# Altium project Capstone_Mainboard_B.PrjPcb (part 2 of 3)

## Sheet Management_RP2040.SchDoc: Management Microcontroller
size B; CheckedBy: Jason Sullins; Author: Jordan Harris-Toovy; Revision: 0.2; SheetNumber: 2; SheetTotal: 22; Size: ANSI B
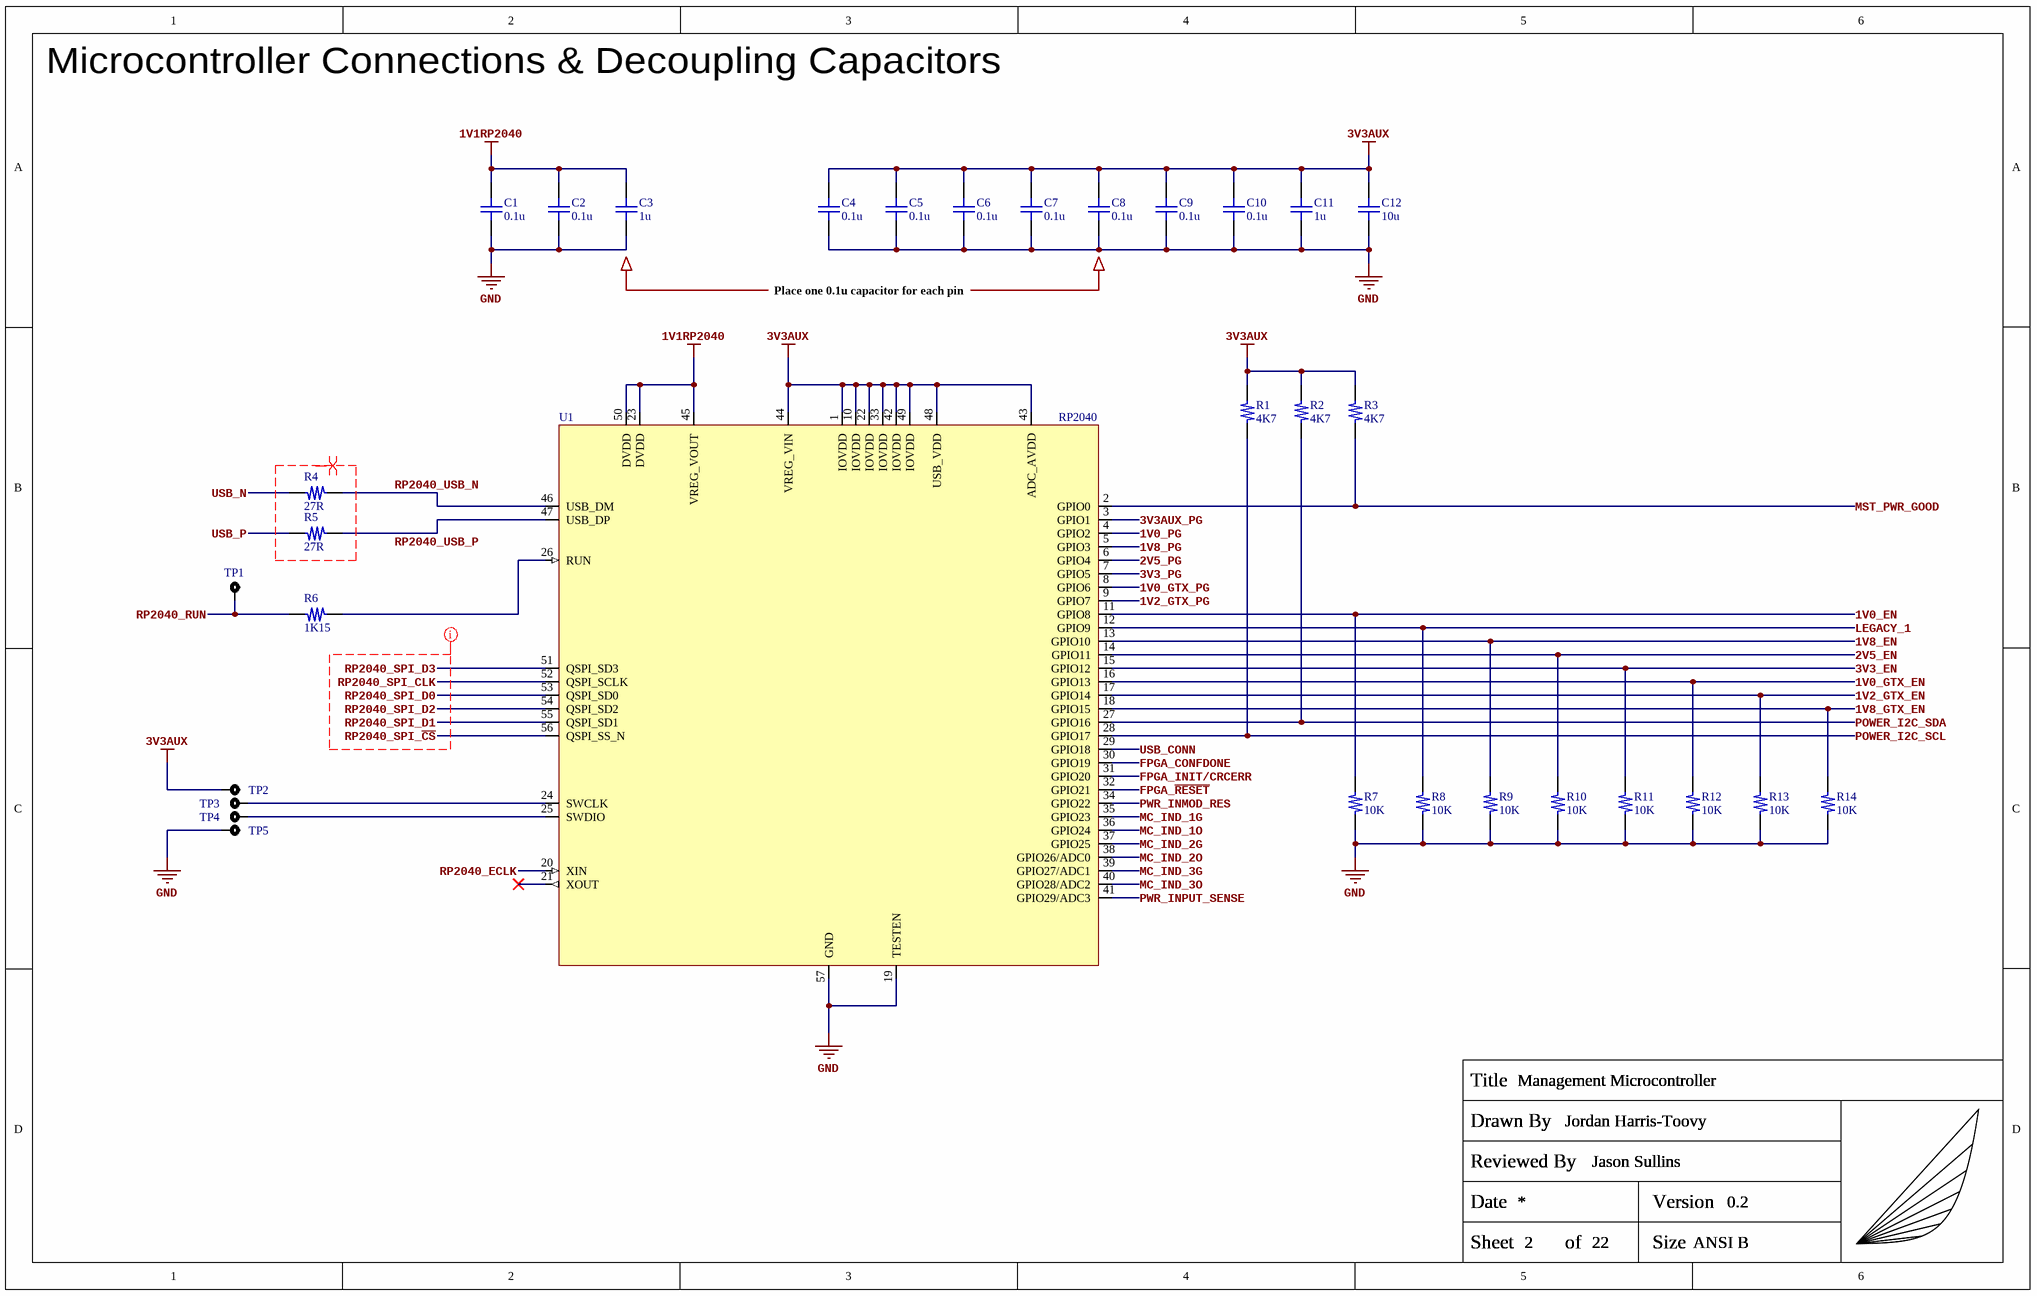
[diagram p11: Management_RP2040.SchDoc]

### Parts
(Parts that share a designator on the sheet are numbered #1, #2 ... from top to bottom, then left to right.)
C1  0.1u  [C_0402_Generic]
C2  0.1u  [C_0402_Generic]
C3  1u  [C_0402_Generic]
C4  0.1u  [C_0402_Generic]
C5  0.1u  [C_0402_Generic]
C6  0.1u  [C_0402_Generic]
C7  0.1u  [C_0402_Generic]
C8  0.1u  [C_0402_Generic]
C9  0.1u  [C_0402_Generic]
C10  0.1u  [C_0402_Generic]
C11  1u  [C_0402_Generic]
C12  10u  [C_0402_Generic]
R1  4K7  [R_0402_Generic]
R2  4K7  [R_0402_Generic]
R3  4K7  [R_0402_Generic]
R4  27R  [R_0402_Generic]
R5  27R  [R_0402_Generic]
R6  1K15  [R_0402_Generic]
R7  10K  [R_0402_Generic]
R8  10K  [R_0402_Generic]
R9  10K  [R_0402_Generic]
R10  10K  [R_0402_Generic]
R11  10K  [R_0402_Generic]
R12  10K  [R_0402_Generic]
R13  10K  [R_0402_Generic]
R14  10K  [R_0402_Generic]
TITLEBLOCK?#12  Capstone_Title_Block  (value not drawn)  (graphical)
TP1  RP2040_RUN Test Point  [TP_3MM]  (value not drawn)
TP2  3V3AUX Test Point  [TP_3MM]  (value not drawn)
TP3  SWCLK Test Point  [TP_3MM]  (value not drawn)
TP4  SWDIO Test Point  [TP_3MM]  (value not drawn)
TP5  SWDGND Test Point  [TP_3MM]  (value not drawn)
U1  RP2040  [RP2040/SC0914 QFN-56]

### Nets
1V1RP2040: C1.2 C2.2 C3.2 U1.23(DVDD) U1.45(VREG_VOUT) U1.50(DVDD)
3V3AUX: C4.2 C5.2 C6.2 C7.2 C8.2 C9.2 C10.2 C11.2 C12.2 R1.2 R2.2 R3.2 TP2.1 U1.1(IOVDD) U1.10(IOVDD) U1.22(IOVDD) U1.33(IOVDD) U1.42(IOVDD) U1.43(ADC_AVDD) U1.44(VREG_VIN) U1.48(USB_VDD) U1.49(IOVDD)
GND: C1.1 C2.1 C3.1 C4.1 C5.1 C6.1 C7.1 C8.1 C9.1 C10.1 C11.1 C12.1 R7.1 R8.1 R9.1 R10.1 R11.1 R12.1 R13.1 R14.1 TP5.1 U1.19(TESTEN) U1.57(GND)
1V0_EN: R7.2 U1.11(GPIO8)
1V0_GTX_EN: R12.2 U1.16(GPIO13)
1V0_GTX_PG: U1.8(GPIO6)
1V0_PG: U1.4(GPIO2)
1V2_GTX_EN: R13.2 U1.17(GPIO14)
1V2_GTX_PG: U1.9(GPIO7)
1V8_EN: R9.2 U1.13(GPIO10)
1V8_GTX_EN: R14.2 U1.18(GPIO15)
1V8_PG: U1.5(GPIO3)
2V5_EN: R10.2 U1.14(GPIO11)
2V5_PG: U1.6(GPIO4)
3V3_EN: R11.2 U1.15(GPIO12)
3V3_PG: U1.7(GPIO5)
3V3AUX_PG: U1.3(GPIO1)
FPGA_CONFDONE: U1.30(GPIO19)
FPGA_INIT/CRCERR: U1.31(GPIO20)
FPGA_~{RESET}: U1.32(GPIO21)
LEGACY_1: R8.2 U1.12(GPIO9)
MC_IND_1G: U1.35(GPIO23)
MC_IND_1O: U1.36(GPIO24)
MC_IND_2G: U1.37(GPIO25)
MC_IND_2O: U1.38(GPIO26/ADC0)
MC_IND_3G: U1.39(GPIO27/ADC1)
MC_IND_3O: U1.40(GPIO28/ADC2)
MST_PWR_GOOD: R3.1 U1.2(GPIO0)
POWER_I2C_SCL: R1.1 U1.28(GPIO17)
POWER_I2C_SDA: R2.1 U1.27(GPIO16)
PWR_INMOD_RES: U1.34(GPIO22)
PWR_INPUT_SENSE: U1.41(GPIO29/ADC3)
RP2040_ECLK: U1.20(XIN)
RP2040_RUN: R6.2 TP1.1
RP2040_SPI_~{CS}: U1.56(QSPI_SS_N)
RP2040_SPI_CLK: U1.52(QSPI_SCLK)
RP2040_SPI_D0: U1.53(QSPI_SD0)
RP2040_SPI_D1: U1.55(QSPI_SD1)
RP2040_SPI_D2: U1.54(QSPI_SD2)
RP2040_SPI_D3: U1.51(QSPI_SD3)
RP2040_USB_N: R4.2 U1.46(USB_DM)
RP2040_USB_P: R5.1 U1.47(USB_DP)
USB_CONN: U1.29(GPIO18)
USB_N: R4.1
USB_P: R5.2
NetR6_1: R6.1 U1.26(RUN)
NetTP3_1: TP3.1 U1.24(SWCLK)
NetTP4_1: TP4.1 U1.25(SWDIO)

Not connected (* = marked no-connect by the designer): U1 21(XOUT)*

### Layout directives
differential pair; differential pair class DP90_USB: (no net found under the mark)
net class SE50_RP2040_FLASH: RP2040_SPI_CLK, RP2040_SPI_D0, RP2040_SPI_D1, RP2040_SPI_D2, RP2040_SPI_D3, RP2040_SPI_~{CS}

### Notes on the sheet
- Microcontroller Connections & Decoupling Capacitors
- Place one 0.1u capacitor for each pin
- (in symbol Capstone_Title_Block) Title; Drawn By; Reviewed By; Date; Version; Sheet; of; Size

### Library data of the parts
C1 C2 C4-C10 = GRM155R71C104KA88D: 0.1µF 16V X7R SMD ceramic capacitor in 0402 size; Manufacturer: Murata Electronics; Manufacturer Part Number: GRM155R71C104KA88D
C3 C11 = GRM155Z71A105KE01D: 1µF 10V X7R SMD ceramic capacitor in 0402 size; Manufacturer: Murata Electronics; Manufacturer Part Number: GRM155Z71A105KE01D
C12 = CC0402MRX5R6BB106: 10µF 10V X5R SMD ceramic capacitor in 0402 size; Manufacturer: YAGEO; Manufacturer Part Number: CC0402MRX5R6BB106
R1-R3 = ERJ-2RKF4701X: 4.7KOhm 1% 1/10W SMD resistor in 0402 size; Manufacturer: Panasonic; Manufacturer Part Number: ERJ-2RKF4701X
R4 R5 = ERJ-2RKF27R0X: 27Ohm 1% 1/10W SMD resistor in 0402 size; Manufacturer: Panasonic; Manufacturer Part Number: ERJ-2RKF27R0X
R6 = ERJ-2RKF1151X: 1.15KOhm 1% 1/10W SMD resistor in 0402 size; Manufacturer: Panasonic; Manufacturer Part Number: ERJ-2RKF1151X
R7-R14 = ERJ-2RKF1002X: 10KOhm 1% 1/10W SMD resistor in 0402 size; Manufacturer: Panasonic; Manufacturer Part Number: ERJ-2RKF1002X
TITLEBLOCK?#12 = Capstone_Title_Block: Custom title block with personal logo; Manufacturer: NONE; Manufacturer Part Number: NONE
TP1-TP5 = SMD Test Point: SMD Test point 3mm circle; Manufacturer: NONE; Manufacturer Part Number: NONE
U1 = RP2040/SC0914: ARM Cortex-M0+ - Microcontroller IC 32-Bit Dual-Core 133MHz External Program Memory 56-QFN (7x7); Manufacturer: Raspberry Pi; Manufacturer Part Number: SC0914(7)

## Sheet FPGA_Power.SchDoc: FPGA Power Banks
size B; CheckedBy: Jason Sullins; Author: Jordan Harris-Toovy; Revision: 0.2; SheetNumber: 16; SheetTotal: 22; Size: ANSI B
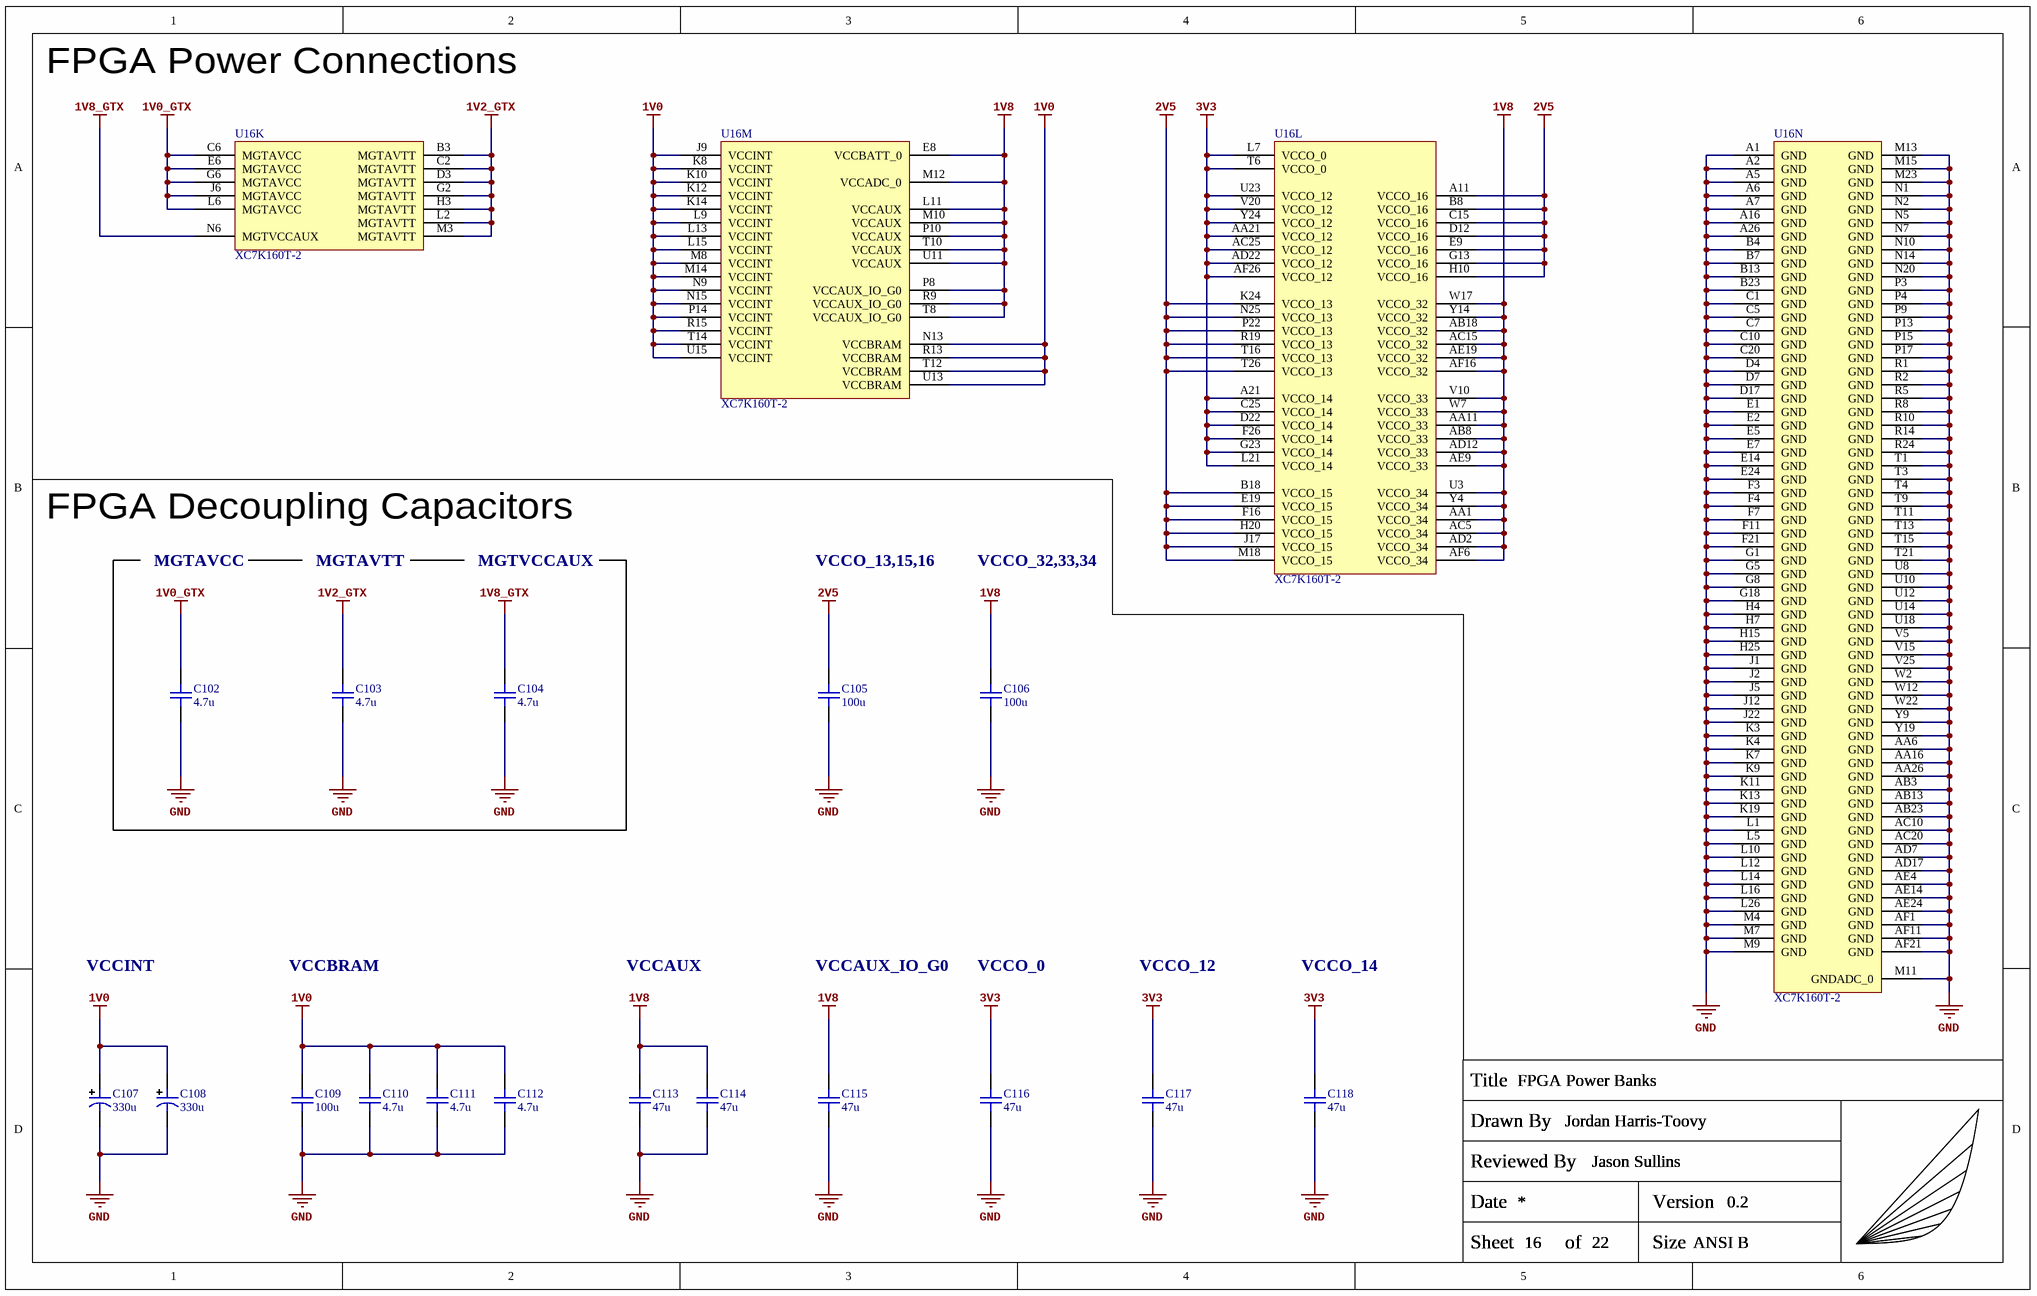
[diagram p12: FPGA_Power.SchDoc]

### Parts
(Parts that share a designator on the sheet are numbered #1, #2 ... from top to bottom, then left to right.)
C102  4.7u  [C_0402_Generic]
C103  4.7u  [C_0402_Generic]
C104  4.7u  [C_0402_Generic]
C105  100u  [C_0805_Generic]
C106  100u  [C_0805_Generic]
C107  330u  [C_TANT_EIA-3528-21_B]
C108  330u  [C_TANT_EIA-3528-21_B]
C109  100u  [C_0805_Generic]
C110  4.7u  [C_0402_Generic]
C111  4.7u  [C_0402_Generic]
C112  4.7u  [C_0402_Generic]
C113  47u  [C_0603_Generic]
C114  47u  [C_0603_Generic]
C115  47u  [C_0603_Generic]
C116  47u  [C_0603_Generic]
C117  47u  [C_0603_Generic]
C118  47u  [C_0603_Generic]
TITLEBLOCK?#13  Capstone_Title_Block  (value not drawn)  (graphical)
U16  XC7K160T-2  [FFG676_(XC7K160T-2FFG676I)]  (parts K,L,M,N of 14)

### Nets
1V0: C107.1 C108.1 C109.2 C110.2 C111.2 C112.2 U16.J9(VCCINT) U16.K8(VCCINT) U16.K10(VCCINT) U16.K12(VCCINT) U16.K14(VCCINT) U16.L9(VCCINT) U16.L13(VCCINT) U16.L15(VCCINT) U16.M8(VCCINT) U16.M14(VCCINT) U16.N9(VCCINT) U16.N13(VCCBRAM) U16.N15(VCCINT) U16.P14(VCCINT) U16.R13(VCCBRAM) U16.R15(VCCINT) U16.T12(VCCBRAM) U16.T14(VCCINT) U16.U13(VCCBRAM) U16.U15(VCCINT)
1V0_GTX: C102.2 U16.C6(MGTAVCC) U16.E6(MGTAVCC) U16.G6(MGTAVCC) U16.J6(MGTAVCC) U16.L6(MGTAVCC)
1V2_GTX: C103.2 U16.B3(MGTAVTT) U16.C2(MGTAVTT) U16.D3(MGTAVTT) U16.G2(MGTAVTT) U16.H3(MGTAVTT) U16.L2(MGTAVTT) U16.M3(MGTAVTT)
1V8: C106.2 C113.2 C114.2 C115.2 U16.AA1(VCCO_34) U16.AA11(VCCO_33) U16.AB8(VCCO_33) U16.AB18(VCCO_32) U16.AC5(VCCO_34) U16.AC15(VCCO_32) U16.AD2(VCCO_34) U16.AD12(VCCO_33) U16.AE9(VCCO_33) U16.AE19(VCCO_32) U16.AF6(VCCO_34) U16.AF16(VCCO_32) U16.E8(VCCBATT_0) U16.L11(VCCAUX) U16.M10(VCCAUX) U16.M12(VCCADC_0) U16.P8(VCCAUX_IO_G0) U16.P10(VCCAUX) U16.R9(VCCAUX_IO_G0) U16.T8(VCCAUX_IO_G0) U16.T10(VCCAUX) U16.U3(VCCO_34) U16.U11(VCCAUX) U16.V10(VCCO_33) U16.W7(VCCO_33) U16.W17(VCCO_32) U16.Y4(VCCO_34) U16.Y14(VCCO_32)
1V8_GTX: C104.2 U16.N6(MGTVCCAUX)
2V5: C105.2 U16.A11(VCCO_16) U16.B8(VCCO_16) U16.B18(VCCO_15) U16.C15(VCCO_16) U16.D12(VCCO_16) U16.E9(VCCO_16) U16.E19(VCCO_15) U16.F16(VCCO_15) U16.G13(VCCO_16) U16.H10(VCCO_16) U16.H20(VCCO_15) U16.J17(VCCO_15) U16.K24(VCCO_13) U16.M18(VCCO_15) U16.N25(VCCO_13) U16.P22(VCCO_13) U16.R19(VCCO_13) U16.T16(VCCO_13) U16.T26(VCCO_13)
3V3: C116.2 C117.2 C118.2 U16.A21(VCCO_14) U16.AA21(VCCO_12) U16.AC25(VCCO_12) U16.AD22(VCCO_12) U16.AF26(VCCO_12) U16.C25(VCCO_14) U16.D22(VCCO_14) U16.F26(VCCO_14) U16.G23(VCCO_14) U16.L7(VCCO_0) U16.L21(VCCO_14) U16.T6(VCCO_0) U16.U23(VCCO_12) U16.V20(VCCO_12) U16.Y24(VCCO_12)
GND: C102.1 C103.1 C104.1 C105.1 C106.1 C107.2 C108.2 C109.1 C110.1 C111.1 C112.1 C113.1 C114.1 C115.1 C116.1 C117.1 C118.1 U16.A1(GND) U16.A2(GND) U16.A5(GND) U16.A6(GND) U16.A7(GND) U16.A16(GND) U16.A26(GND) U16.AA6(GND) U16.AA16(GND) U16.AA26(GND) U16.AB3(GND) U16.AB13(GND) U16.AB23(GND) U16.AC10(GND) U16.AC20(GND) U16.AD7(GND) U16.AD17(GND) U16.AE4(GND) U16.AE14(GND) U16.AE24(GND) U16.AF1(GND) U16.AF11(GND) U16.AF21(GND) U16.B4(GND) U16.B7(GND) U16.B13(GND) U16.B23(GND) U16.C1(GND) U16.C5(GND) U16.C7(GND) U16.C10(GND) U16.C20(GND) U16.D4(GND) U16.D7(GND) U16.D17(GND) U16.E1(GND) U16.E2(GND) U16.E5(GND) U16.E7(GND) U16.E14(GND) U16.E24(GND) U16.F3(GND) U16.F4(GND) U16.F7(GND) U16.F11(GND) U16.F21(GND) U16.G1(GND) U16.G5(GND) U16.G8(GND) U16.G18(GND) U16.H4(GND) U16.H7(GND) U16.H15(GND) U16.H25(GND) U16.J1(GND) U16.J2(GND) U16.J5(GND) U16.J12(GND) U16.J22(GND) U16.K3(GND) U16.K4(GND) U16.K7(GND) U16.K9(GND) U16.K11(GND) U16.K13(GND) U16.K19(GND) U16.L1(GND) U16.L5(GND) U16.L10(GND) U16.L12(GND) U16.L14(GND) U16.L16(GND) U16.L26(GND) U16.M4(GND) U16.M7(GND) U16.M9(GND) U16.M11(GNDADC_0) U16.M13(GND) U16.M15(GND) U16.M23(GND) U16.N1(GND) U16.N2(GND) U16.N5(GND) U16.N7(GND) U16.N10(GND) U16.N14(GND) U16.N20(GND) U16.P3(GND) U16.P4(GND) U16.P9(GND) U16.P13(GND) U16.P15(GND) U16.P17(GND) U16.R1(GND) U16.R2(GND) U16.R5(GND) U16.R8(GND) U16.R10(GND) U16.R14(GND) U16.R24(GND) U16.T1(GND) U16.T3(GND) U16.T4(GND) U16.T9(GND) U16.T11(GND) U16.T13(GND) U16.T15(GND) U16.T21(GND) U16.U8(GND) U16.U10(GND) U16.U12(GND) U16.U14(GND) U16.U18(GND) U16.V5(GND) U16.V15(GND) U16.V25(GND) U16.W2(GND) U16.W12(GND) U16.W22(GND) U16.Y9(GND) U16.Y19(GND)

### Notes on the sheet
- FPGA Power Connections
- FPGA Decoupling Capacitors
- MGTAVCC
- MGTAVTT
- MGTVCCAUX
- VCCO_13,15,16
- VCCO_32,33,34
- VCCINT
- VCCBRAM
- VCCAUX
- VCCAUX_IO_G0
- VCCO_0
- VCCO_12
- VCCO_14
- (in symbol Capstone_Title_Block) Title; Drawn By; Reviewed By; Date; Version; Sheet; of; Size

### Library data of the parts
C102-C104 C110-C112 = GRM155R61A475MEAAJ: 4.7µF 10V X5R SMD ceramic capacitor in 0402 size; Manufacturer: Murata Electronics; Manufacturer Part Number: GRM155R61A475MEAAJ
C105 C106 C109 = GRM21BR60J107ME15L: 100µF 6.3V X5R SMD ceramic capacitor in 0805 size; Manufacturer: Murata Electronics; Manufacturer Part Number: GRM21BR60J107ME15L
C107 C108 = T520B337M2R5ATE015: 330µF 2.5V 15mOhm SMD tantalum capacitor in EIA-3528-21size; Manufacturer: KEMET; Manufacturer Part Number: T520B337M2R5ATE015
C113-C118 = GRM188R60J476ME15D: 47µF 6.3V X5R SMD ceramic capacitor in 0603 size; Manufacturer: Murata Electronics; Manufacturer Part Number: GRM188R60J476ME15D
TITLEBLOCK?#13 = Capstone_Title_Block: as TITLEBLOCK?#12 on sheet Management_RP2040; Manufacturer Part Number: NONE
U16 = XC7K160T-2FFG676I: Kintex-7 FPGA, 400 User I/Os, 8 GTX, 676-Ball BGA, Speed Grade 2, Industrial Grade, Pb-Free; Manufacturer: AMD/Xilinx; Manufacturer Part Number: XC7K160T-2FFG676I

## Sheet FGPA_Configuration.SchDoc: FPGA Configuration Banks
size B; CheckedBy: Jason Sullins; Author: Jordan Harris-Toovy; Revision: 0.2; SheetNumber: 17; SheetTotal: 22; Size: ANSI B
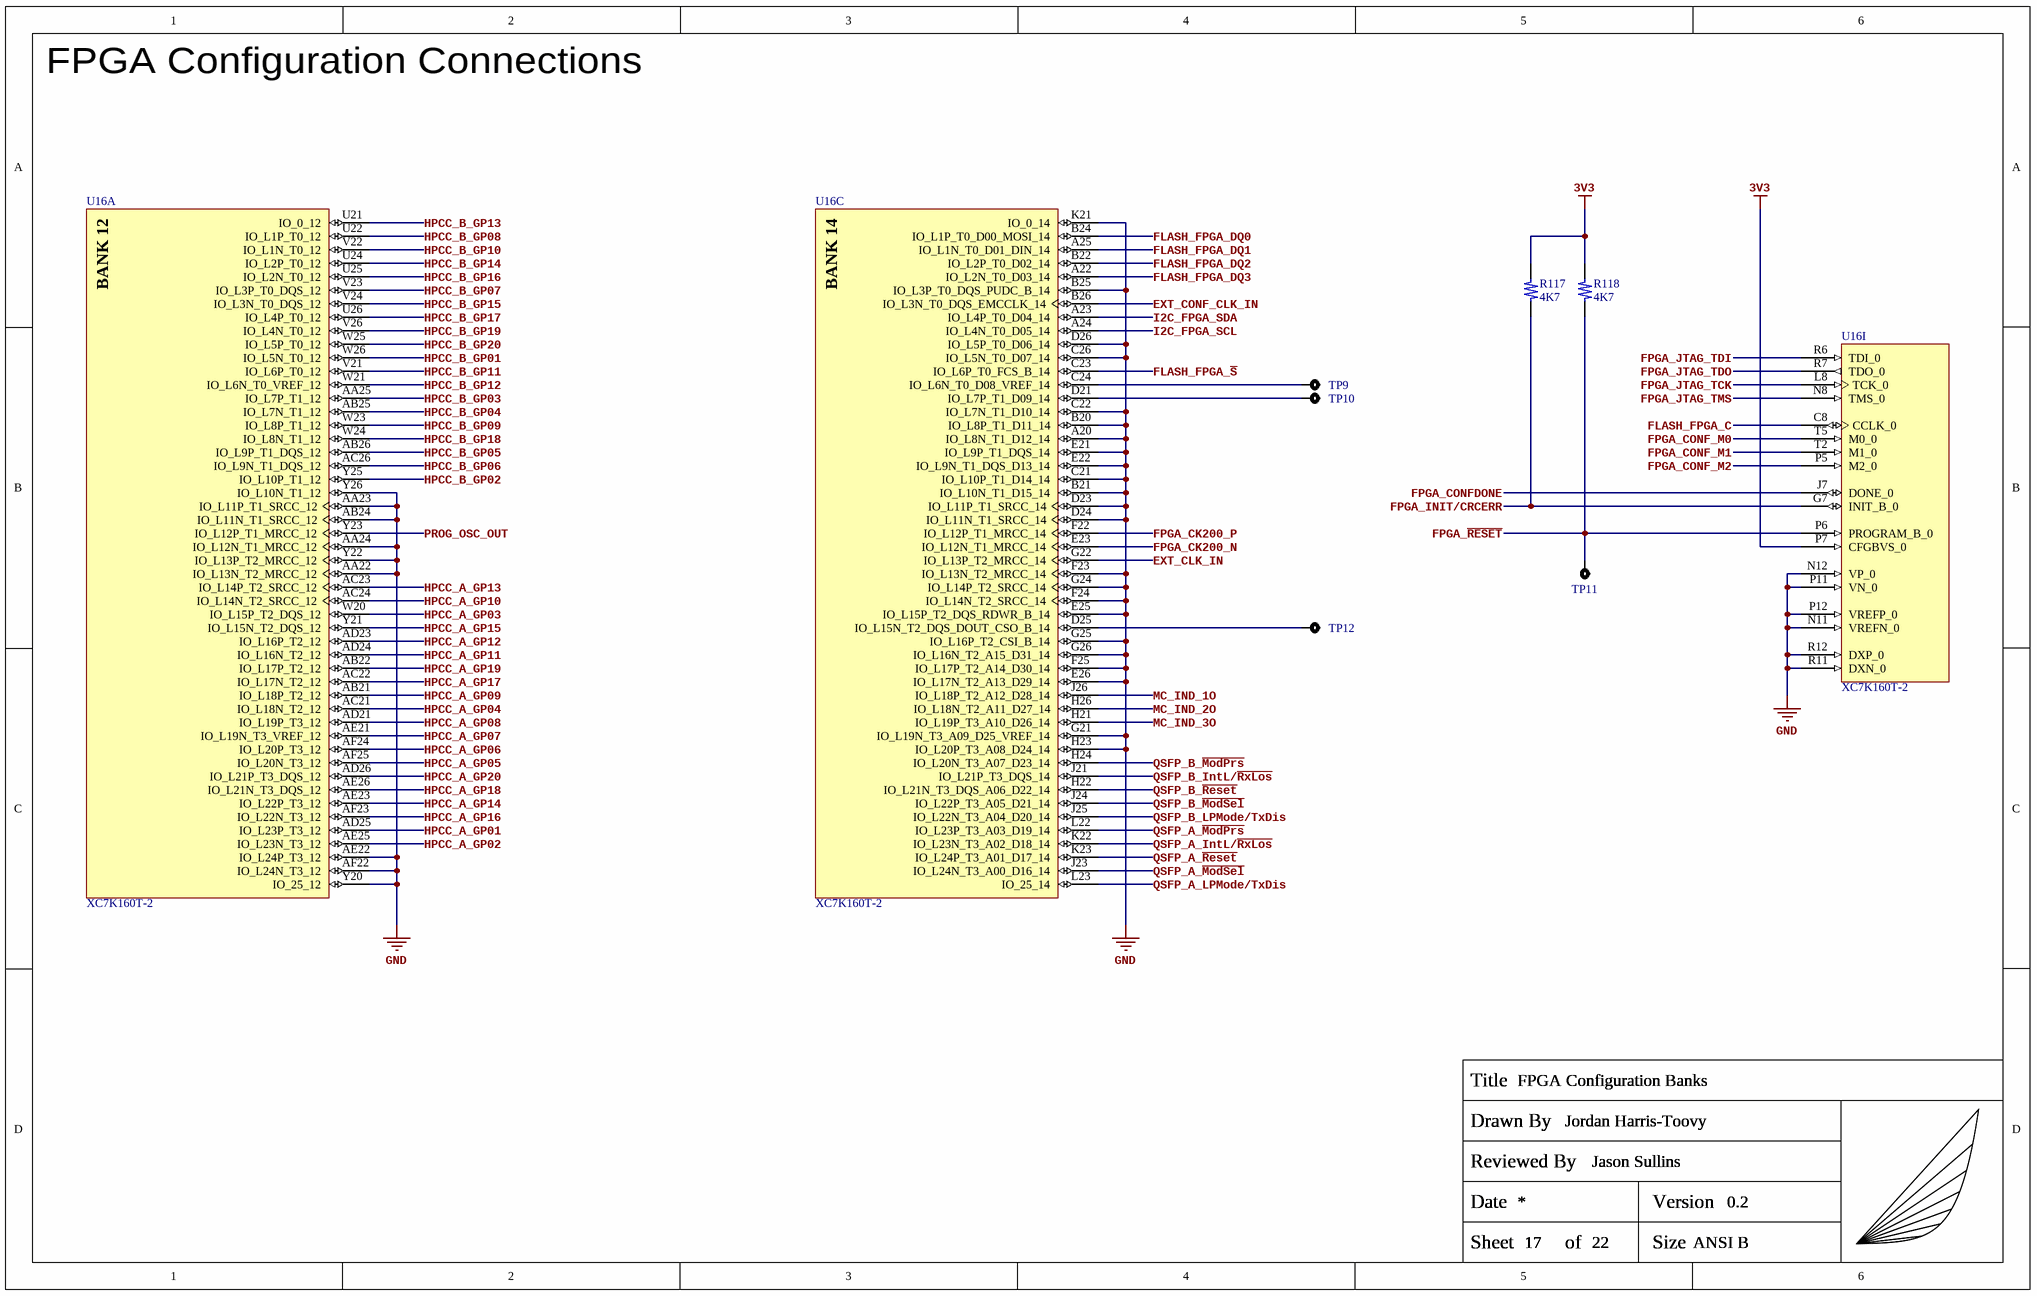
[diagram p13: FGPA_Configuration.SchDoc]

### Parts
(Parts that share a designator on the sheet are numbered #1, #2 ... from top to bottom, then left to right.)
R117  4K7  [R_0402_Generic]
R118  4K7  [R_0402_Generic]
TITLEBLOCK?#14  Capstone_Title_Block  (value not drawn)  (graphical)
TP9  FPGA B14 L6N/VREF Test Point  [TP_3MM]  (value not drawn)
TP10  FPGA B14 L7P Test Point  [TP_3MM]  (value not drawn)
TP11  FPGA nRESET Test Point  [TP_3MM]  (value not drawn)
TP12  FPGA DOUT Test Point  [TP_3MM]  (value not drawn)
U16  XC7K160T-2  [FFG676_(XC7K160T-2FFG676I)]  (parts A,C,I of 14)

### Nets
3V3: R117.2 R118.2 U16.P7(CFGBVS_0)
GND: U16.A20(IO_L8N_T1_D12_14) U16.AA22(IO_L13N_T2_MRCC_12) U16.AA23(IO_L11P_T1_SRCC_12) U16.AA24(IO_L12N_T1_MRCC_12) U16.AB24(IO_L11N_T1_SRCC_12) U16.AE22(IO_L24P_T3_12) U16.AF22(IO_L24N_T3_12) U16.B20(IO_L8P_T1_D11_14) U16.B21(IO_L10N_T1_D15_14) U16.B25(IO_L3P_T0_DQS_PUDC_B_14) U16.C21(IO_L10P_T1_D14_14) U16.C22(IO_L7N_T1_D10_14) U16.C26(IO_L5N_T0_D07_14) U16.D23(IO_L11P_T1_SRCC_14) U16.D24(IO_L11N_T1_SRCC_14) U16.D26(IO_L5P_T0_D06_14) U16.E21(IO_L9P_T1_DQS_14) U16.E22(IO_L9N_T1_DQS_D13_14) U16.E25(IO_L15P_T2_DQS_RDWR_B_14) U16.E26(IO_L17N_T2_A13_D29_14) U16.F23(IO_L13N_T2_MRCC_14) U16.F24(IO_L14N_T2_SRCC_14) U16.F25(IO_L17P_T2_A14_D30_14) U16.G21(IO_L19N_T3_A09_D25_VREF_14) U16.G24(IO_L14P_T2_SRCC_14) U16.G25(IO_L16P_T2_CSI_B_14) U16.G26(IO_L16N_T2_A15_D31_14) U16.H23(IO_L20P_T3_A08_D24_14) U16.K21(IO_0_14) U16.N11(VREFN_0) U16.N12(VP_0) U16.P11(VN_0) U16.P12(VREFP_0) U16.R11(DXN_0) U16.R12(DXP_0) U16.Y20(IO_25_12) U16.Y22(IO_L13P_T2_MRCC_12) U16.Y26(IO_L10N_T1_12)
EXT_CLK_IN: U16.G22(IO_L13P_T2_MRCC_14)
EXT_CONF_CLK_IN: U16.B26(IO_L3N_T0_DQS_EMCCLK_14)
FLASH_FPGA_C: U16.C8(CCLK_0)
FLASH_FPGA_DQ0: U16.B24(IO_L1P_T0_D00_MOSI_14)
FLASH_FPGA_DQ1: U16.A25(IO_L1N_T0_D01_DIN_14)
FLASH_FPGA_DQ2: U16.B22(IO_L2P_T0_D02_14)
FLASH_FPGA_DQ3: U16.A22(IO_L2N_T0_D03_14)
FLASH_FPGA_~{S}: U16.C23(IO_L6P_T0_FCS_B_14)
FPGA_CK200_N: U16.E23(IO_L12N_T1_MRCC_14)
FPGA_CK200_P: U16.F22(IO_L12P_T1_MRCC_14)
FPGA_CONF_M0: U16.T5(M0_0)
FPGA_CONF_M1: U16.T2(M1_0)
FPGA_CONF_M2: U16.P5(M2_0)
FPGA_CONFDONE: U16.J7(DONE_0)
FPGA_INIT/CRCERR: R117.1 U16.G7(INIT_B_0)
FPGA_JTAG_TCK: U16.L8(TCK_0)
FPGA_JTAG_TDI: U16.R6(TDI_0)
FPGA_JTAG_TDO: U16.R7(TDO_0)
FPGA_JTAG_TMS: U16.N8(TMS_0)
FPGA_~{RESET}: R118.1 TP11.1 U16.P6(PROGRAM_B_0)
HPCC_A_GP01: U16.AD25(IO_L23P_T3_12)
HPCC_A_GP02: U16.AE25(IO_L23N_T3_12)
HPCC_A_GP03: U16.W20(IO_L15P_T2_DQS_12)
HPCC_A_GP04: U16.AC21(IO_L18N_T2_12)
HPCC_A_GP05: U16.AF25(IO_L20N_T3_12)
HPCC_A_GP06: U16.AF24(IO_L20P_T3_12)
HPCC_A_GP07: U16.AE21(IO_L19N_T3_VREF_12)
HPCC_A_GP08: U16.AD21(IO_L19P_T3_12)
HPCC_A_GP09: U16.AB21(IO_L18P_T2_12)
HPCC_A_GP10: U16.AC24(IO_L14N_T2_SRCC_12)
HPCC_A_GP11: U16.AD24(IO_L16N_T2_12)
HPCC_A_GP12: U16.AD23(IO_L16P_T2_12)
HPCC_A_GP13: U16.AC23(IO_L14P_T2_SRCC_12)
HPCC_A_GP14: U16.AE23(IO_L22P_T3_12)
HPCC_A_GP15: U16.Y21(IO_L15N_T2_DQS_12)
HPCC_A_GP16: U16.AF23(IO_L22N_T3_12)
HPCC_A_GP17: U16.AC22(IO_L17N_T2_12)
HPCC_A_GP18: U16.AE26(IO_L21N_T3_DQS_12)
HPCC_A_GP19: U16.AB22(IO_L17P_T2_12)
HPCC_A_GP20: U16.AD26(IO_L21P_T3_DQS_12)
HPCC_B_GP01: U16.W26(IO_L5N_T0_12)
HPCC_B_GP02: U16.Y25(IO_L10P_T1_12)
HPCC_B_GP03: U16.AA25(IO_L7P_T1_12)
HPCC_B_GP04: U16.AB25(IO_L7N_T1_12)
HPCC_B_GP05: U16.AB26(IO_L9P_T1_DQS_12)
HPCC_B_GP06: U16.AC26(IO_L9N_T1_DQS_12)
HPCC_B_GP07: U16.V23(IO_L3P_T0_DQS_12)
HPCC_B_GP08: U16.U22(IO_L1P_T0_12)
HPCC_B_GP09: U16.W23(IO_L8P_T1_12)
HPCC_B_GP10: U16.V22(IO_L1N_T0_12)
HPCC_B_GP11: U16.V21(IO_L6P_T0_12)
HPCC_B_GP12: U16.W21(IO_L6N_T0_VREF_12)
HPCC_B_GP13: U16.U21(IO_0_12)
HPCC_B_GP14: U16.U24(IO_L2P_T0_12)
HPCC_B_GP15: U16.V24(IO_L3N_T0_DQS_12)
HPCC_B_GP16: U16.U25(IO_L2N_T0_12)
HPCC_B_GP17: U16.U26(IO_L4P_T0_12)
HPCC_B_GP18: U16.W24(IO_L8N_T1_12)
HPCC_B_GP19: U16.V26(IO_L4N_T0_12)
HPCC_B_GP20: U16.W25(IO_L5P_T0_12)
I2C_FPGA_SCL: U16.A24(IO_L4N_T0_D05_14)
I2C_FPGA_SDA: U16.A23(IO_L4P_T0_D04_14)
MC_IND_1O: U16.J26(IO_L18P_T2_A12_D28_14)
MC_IND_2O: U16.H26(IO_L18N_T2_A11_D27_14)
MC_IND_3O: U16.H21(IO_L19P_T3_A10_D26_14)
PROG_OSC_OUT: U16.Y23(IO_L12P_T1_MRCC_12)
QSFP_A_IntL/~{RxLos}: U16.K22(IO_L23N_T3_A02_D18_14)
QSFP_A_LPMode/TxDis: U16.L23(IO_25_14)
QSFP_A_~{ModPrs}: U16.L22(IO_L23P_T3_A03_D19_14)
QSFP_A_~{ModSel}: U16.J23(IO_L24N_T3_A00_D16_14)
QSFP_A_~{Reset}: U16.K23(IO_L24P_T3_A01_D17_14)
QSFP_B_IntL/~{RxLos}: U16.J21(IO_L21P_T3_DQS_14)
QSFP_B_LPMode/TxDis: U16.J25(IO_L22N_T3_A04_D20_14)
QSFP_B_~{ModPrs}: U16.H24(IO_L20N_T3_A07_D23_14)
QSFP_B_~{ModSel}: U16.J24(IO_L22P_T3_A05_D21_14)
QSFP_B_~{Reset}: U16.H22(IO_L21N_T3_DQS_A06_D22_14)
NetTP9_1: TP9.1 U16.C24(IO_L6N_T0_D08_VREF_14)
NetTP10_1: TP10.1 U16.D21(IO_L7P_T1_D09_14)
NetTP12_1: TP12.1 U16.D25(IO_L15N_T2_DQS_DOUT_CSO_B_14)

### Notes on the sheet
- FPGA Configuration Connections
- (in symbol Capstone_Title_Block) Title; Drawn By; Reviewed By; Date; Version; Sheet; of; Size
- (in symbol XC7K160T-2FFG676I, part A) BANK 12
- (in symbol XC7K160T-2FFG676I, part C) BANK 14

### Library data of the parts
R117 R118 = ERJ-2RKF4701X: as R1-R3 on sheet Management_RP2040; Manufacturer Part Number: ERJ-2RKF4701X
TITLEBLOCK?#14 = Capstone_Title_Block: as TITLEBLOCK?#12 on sheet Management_RP2040; Manufacturer Part Number: NONE
TP9-TP12 = SMD Test Point: as TP1-TP5 on sheet Management_RP2040; Manufacturer Part Number: NONE
U16 = XC7K160T-2FFG676I: as U16 on sheet FPGA_Power; Manufacturer Part Number: XC7K160T-2FFG676I

## Sheet FPGA_HPCC_A_DPs.SchDoc: FPGA Differential Pairs for HPCC A
size B; CheckedBy: Jason Sullins; Author: Jordan Harris-Toovy; Revision: 0.2; SheetNumber: 18; SheetTotal: 22; Size: ANSI B
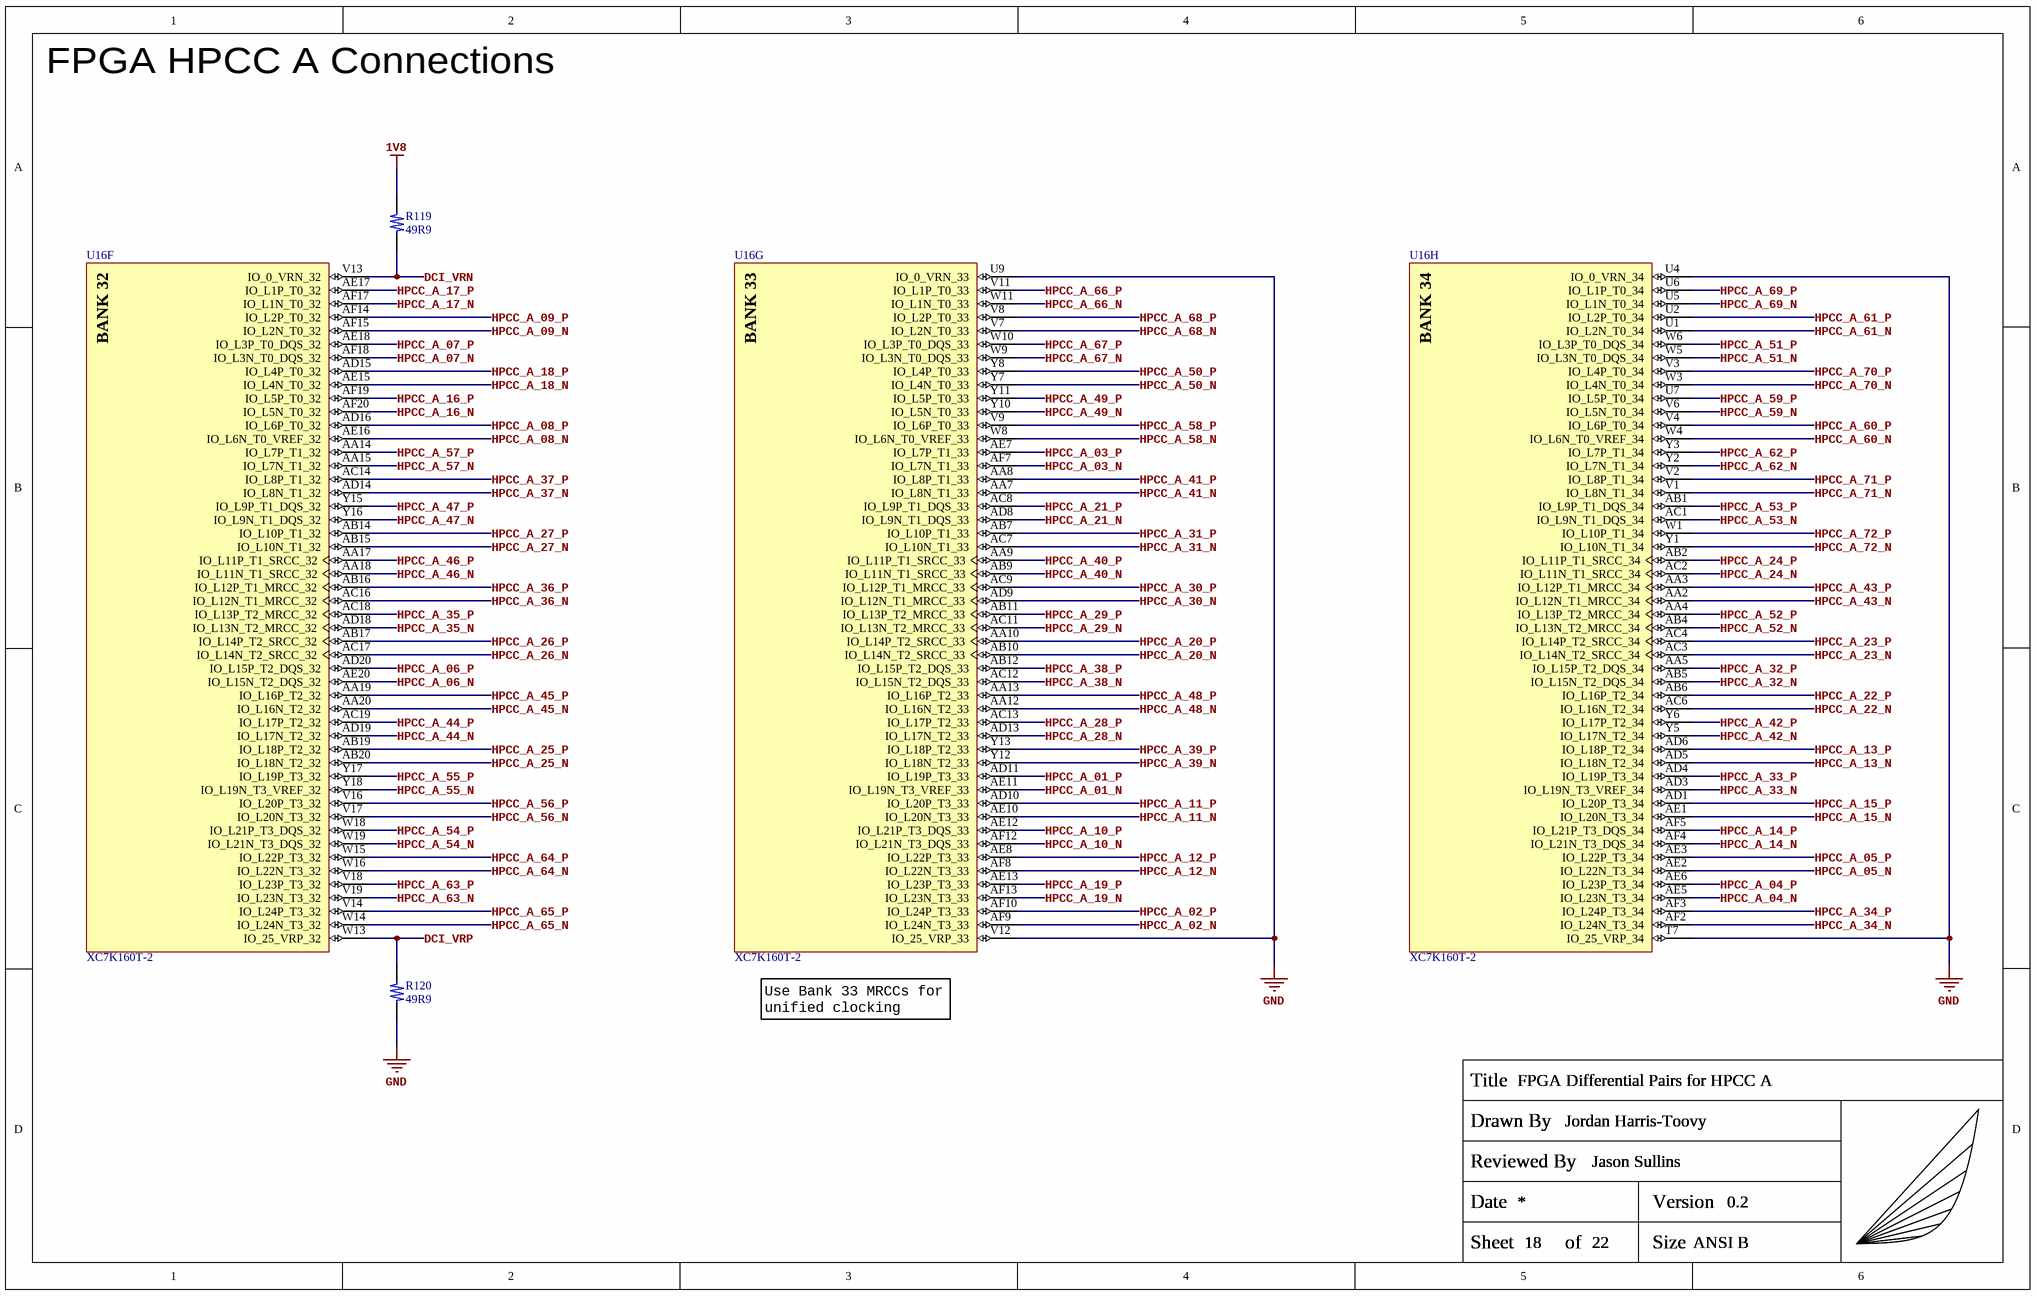
[diagram p14: FPGA_HPCC_A_DPs.SchDoc]

### Parts
(Parts that share a designator on the sheet are numbered #1, #2 ... from top to bottom, then left to right.)
R119  49R9  [R_0402_Generic]
R120  49R9  [R_0402_Generic]
TITLEBLOCK?#15  Capstone_Title_Block  (value not drawn)  (graphical)
U16  XC7K160T-2  [FFG676_(XC7K160T-2FFG676I)]  (parts F,G,H of 14)

### Nets
1V8: R119.2
GND: R120.1 U16.T7(IO_25_VRP_34) U16.U4(IO_0_VRN_34) U16.U9(IO_0_VRN_33) U16.V12(IO_25_VRP_33)
DCI_VRN: R119.1 U16.V13(IO_0_VRN_32)
DCI_VRP: R120.2 U16.W13(IO_25_VRP_32)
HPCC_A_01_N: U16.AE11(IO_L19N_T3_VREF_33)
HPCC_A_01_P: U16.AD11(IO_L19P_T3_33)
HPCC_A_02_N: U16.AF9(IO_L24N_T3_33)
HPCC_A_02_P: U16.AF10(IO_L24P_T3_33)
HPCC_A_03_N: U16.AF7(IO_L7N_T1_33)
HPCC_A_03_P: U16.AE7(IO_L7P_T1_33)
HPCC_A_04_N: U16.AE5(IO_L23N_T3_34)
HPCC_A_04_P: U16.AE6(IO_L23P_T3_34)
HPCC_A_05_N: U16.AE2(IO_L22N_T3_34)
HPCC_A_05_P: U16.AE3(IO_L22P_T3_34)
HPCC_A_06_N: U16.AE20(IO_L15N_T2_DQS_32)
HPCC_A_06_P: U16.AD20(IO_L15P_T2_DQS_32)
HPCC_A_07_N: U16.AF18(IO_L3N_T0_DQS_32)
HPCC_A_07_P: U16.AE18(IO_L3P_T0_DQS_32)
HPCC_A_08_N: U16.AE16(IO_L6N_T0_VREF_32)
HPCC_A_08_P: U16.AD16(IO_L6P_T0_32)
HPCC_A_09_N: U16.AF15(IO_L2N_T0_32)
HPCC_A_09_P: U16.AF14(IO_L2P_T0_32)
HPCC_A_10_N: U16.AF12(IO_L21N_T3_DQS_33)
HPCC_A_10_P: U16.AE12(IO_L21P_T3_DQS_33)
HPCC_A_11_N: U16.AE10(IO_L20N_T3_33)
HPCC_A_11_P: U16.AD10(IO_L20P_T3_33)
HPCC_A_12_N: U16.AF8(IO_L22N_T3_33)
HPCC_A_12_P: U16.AE8(IO_L22P_T3_33)
HPCC_A_13_N: U16.AD5(IO_L18N_T2_34)
HPCC_A_13_P: U16.AD6(IO_L18P_T2_34)
HPCC_A_14_N: U16.AF4(IO_L21N_T3_DQS_34)
HPCC_A_14_P: U16.AF5(IO_L21P_T3_DQS_34)
HPCC_A_15_N: U16.AE1(IO_L20N_T3_34)
HPCC_A_15_P: U16.AD1(IO_L20P_T3_34)
HPCC_A_16_N: U16.AF20(IO_L5N_T0_32)
HPCC_A_16_P: U16.AF19(IO_L5P_T0_32)
HPCC_A_17_N: U16.AF17(IO_L1N_T0_32)
HPCC_A_17_P: U16.AE17(IO_L1P_T0_32)
HPCC_A_18_N: U16.AE15(IO_L4N_T0_32)
HPCC_A_18_P: U16.AD15(IO_L4P_T0_32)
HPCC_A_19_N: U16.AF13(IO_L23N_T3_33)
HPCC_A_19_P: U16.AE13(IO_L23P_T3_33)
HPCC_A_20_N: U16.AB10(IO_L14N_T2_SRCC_33)
HPCC_A_20_P: U16.AA10(IO_L14P_T2_SRCC_33)
HPCC_A_21_N: U16.AD8(IO_L9N_T1_DQS_33)
HPCC_A_21_P: U16.AC8(IO_L9P_T1_DQS_33)
HPCC_A_22_N: U16.AC6(IO_L16N_T2_34)
HPCC_A_22_P: U16.AB6(IO_L16P_T2_34)
HPCC_A_23_N: U16.AC3(IO_L14N_T2_SRCC_34)
HPCC_A_23_P: U16.AC4(IO_L14P_T2_SRCC_34)
HPCC_A_24_N: U16.AC2(IO_L11N_T1_SRCC_34)
HPCC_A_24_P: U16.AB2(IO_L11P_T1_SRCC_34)
HPCC_A_25_N: U16.AB20(IO_L18N_T2_32)
HPCC_A_25_P: U16.AB19(IO_L18P_T2_32)
HPCC_A_26_N: U16.AC17(IO_L14N_T2_SRCC_32)
HPCC_A_26_P: U16.AB17(IO_L14P_T2_SRCC_32)
HPCC_A_27_N: U16.AB15(IO_L10N_T1_32)
HPCC_A_27_P: U16.AB14(IO_L10P_T1_32)
HPCC_A_28_N: U16.AD13(IO_L17N_T2_33)
HPCC_A_28_P: U16.AC13(IO_L17P_T2_33)
HPCC_A_29_N: U16.AC11(IO_L13N_T2_MRCC_33)
HPCC_A_29_P: U16.AB11(IO_L13P_T2_MRCC_33)
HPCC_A_30_N: U16.AD9(IO_L12N_T1_MRCC_33)
HPCC_A_30_P: U16.AC9(IO_L12P_T1_MRCC_33)
HPCC_A_31_N: U16.AC7(IO_L10N_T1_33)
HPCC_A_31_P: U16.AB7(IO_L10P_T1_33)
HPCC_A_32_N: U16.AB5(IO_L15N_T2_DQS_34)
HPCC_A_32_P: U16.AA5(IO_L15P_T2_DQS_34)
HPCC_A_33_N: U16.AD3(IO_L19N_T3_VREF_34)
HPCC_A_33_P: U16.AD4(IO_L19P_T3_34)
HPCC_A_34_N: U16.AF2(IO_L24N_T3_34)
HPCC_A_34_P: U16.AF3(IO_L24P_T3_34)
HPCC_A_35_N: U16.AD18(IO_L13N_T2_MRCC_32)
HPCC_A_35_P: U16.AC18(IO_L13P_T2_MRCC_32)
HPCC_A_36_N: U16.AC16(IO_L12N_T1_MRCC_32)
HPCC_A_36_P: U16.AB16(IO_L12P_T1_MRCC_32)
HPCC_A_37_N: U16.AD14(IO_L8N_T1_32)
HPCC_A_37_P: U16.AC14(IO_L8P_T1_32)
HPCC_A_38_N: U16.AC12(IO_L15N_T2_DQS_33)
HPCC_A_38_P: U16.AB12(IO_L15P_T2_DQS_33)
HPCC_A_39_N: U16.Y12(IO_L18N_T2_33)
HPCC_A_39_P: U16.Y13(IO_L18P_T2_33)
HPCC_A_40_N: U16.AB9(IO_L11N_T1_SRCC_33)
HPCC_A_40_P: U16.AA9(IO_L11P_T1_SRCC_33)
HPCC_A_41_N: U16.AA7(IO_L8N_T1_33)
HPCC_A_41_P: U16.AA8(IO_L8P_T1_33)
HPCC_A_42_N: U16.Y5(IO_L17N_T2_34)
HPCC_A_42_P: U16.Y6(IO_L17P_T2_34)
HPCC_A_43_N: U16.AA2(IO_L12N_T1_MRCC_34)
HPCC_A_43_P: U16.AA3(IO_L12P_T1_MRCC_34)
HPCC_A_44_N: U16.AD19(IO_L17N_T2_32)
HPCC_A_44_P: U16.AC19(IO_L17P_T2_32)
HPCC_A_45_N: U16.AA20(IO_L16N_T2_32)
HPCC_A_45_P: U16.AA19(IO_L16P_T2_32)
HPCC_A_46_N: U16.AA18(IO_L11N_T1_SRCC_32)
HPCC_A_46_P: U16.AA17(IO_L11P_T1_SRCC_32)
HPCC_A_47_N: U16.Y16(IO_L9N_T1_DQS_32)
HPCC_A_47_P: U16.Y15(IO_L9P_T1_DQS_32)
HPCC_A_48_N: U16.AA12(IO_L16N_T2_33)
HPCC_A_48_P: U16.AA13(IO_L16P_T2_33)
HPCC_A_49_N: U16.Y10(IO_L5N_T0_33)
HPCC_A_49_P: U16.Y11(IO_L5P_T0_33)
HPCC_A_50_N: U16.Y7(IO_L4N_T0_33)
HPCC_A_50_P: U16.Y8(IO_L4P_T0_33)
HPCC_A_51_N: U16.W5(IO_L3N_T0_DQS_34)
HPCC_A_51_P: U16.W6(IO_L3P_T0_DQS_34)
HPCC_A_52_N: U16.AB4(IO_L13N_T2_MRCC_34)
HPCC_A_52_P: U16.AA4(IO_L13P_T2_MRCC_34)
HPCC_A_53_N: U16.AC1(IO_L9N_T1_DQS_34)
HPCC_A_53_P: U16.AB1(IO_L9P_T1_DQS_34)
HPCC_A_54_N: U16.W19(IO_L21N_T3_DQS_32)
HPCC_A_54_P: U16.W18(IO_L21P_T3_DQS_32)
HPCC_A_55_N: U16.Y18(IO_L19N_T3_VREF_32)
HPCC_A_55_P: U16.Y17(IO_L19P_T3_32)
HPCC_A_56_N: U16.V17(IO_L20N_T3_32)
HPCC_A_56_P: U16.V16(IO_L20P_T3_32)
HPCC_A_57_N: U16.AA15(IO_L7N_T1_32)
HPCC_A_57_P: U16.AA14(IO_L7P_T1_32)
HPCC_A_58_N: U16.W8(IO_L6N_T0_VREF_33)
HPCC_A_58_P: U16.V9(IO_L6P_T0_33)
HPCC_A_59_N: U16.V6(IO_L5N_T0_34)
HPCC_A_59_P: U16.U7(IO_L5P_T0_34)
HPCC_A_60_N: U16.W4(IO_L6N_T0_VREF_34)
HPCC_A_60_P: U16.V4(IO_L6P_T0_34)
HPCC_A_61_N: U16.U1(IO_L2N_T0_34)
HPCC_A_61_P: U16.U2(IO_L2P_T0_34)
HPCC_A_62_N: U16.Y2(IO_L7N_T1_34)
HPCC_A_62_P: U16.Y3(IO_L7P_T1_34)
HPCC_A_63_N: U16.V19(IO_L23N_T3_32)
HPCC_A_63_P: U16.V18(IO_L23P_T3_32)
HPCC_A_64_N: U16.W16(IO_L22N_T3_32)
HPCC_A_64_P: U16.W15(IO_L22P_T3_32)
HPCC_A_65_N: U16.W14(IO_L24N_T3_32)
HPCC_A_65_P: U16.V14(IO_L24P_T3_32)
HPCC_A_66_N: U16.W11(IO_L1N_T0_33)
HPCC_A_66_P: U16.V11(IO_L1P_T0_33)
HPCC_A_67_N: U16.W9(IO_L3N_T0_DQS_33)
HPCC_A_67_P: U16.W10(IO_L3P_T0_DQS_33)
HPCC_A_68_N: U16.V7(IO_L2N_T0_33)
HPCC_A_68_P: U16.V8(IO_L2P_T0_33)
HPCC_A_69_N: U16.U5(IO_L1N_T0_34)
HPCC_A_69_P: U16.U6(IO_L1P_T0_34)
HPCC_A_70_N: U16.W3(IO_L4N_T0_34)
HPCC_A_70_P: U16.V3(IO_L4P_T0_34)
HPCC_A_71_N: U16.V1(IO_L8N_T1_34)
HPCC_A_71_P: U16.V2(IO_L8P_T1_34)
HPCC_A_72_N: U16.Y1(IO_L10N_T1_34)
HPCC_A_72_P: U16.W1(IO_L10P_T1_34)

### Notes on the sheet
- FPGA HPCC A Connections
- (near U16) Use Bank 33 MRCCs for unified clocking
- (in symbol Capstone_Title_Block) Title; Drawn By; Reviewed By; Date; Version; Sheet; of; Size
- (in symbol XC7K160T-2FFG676I, part F) BANK 32
- (in symbol XC7K160T-2FFG676I, part G) BANK 33
- (in symbol XC7K160T-2FFG676I, part H) BANK 34

### Library data of the parts
R119 R120 = ERJ-2RKD49R9X: 49.9Ohm 0.5% 1/16W SMD resistor in 0402 size; Manufacturer: Panasonic; Manufacturer Part Number: ERJ-2RKD49R9X
TITLEBLOCK?#15 = Capstone_Title_Block: as TITLEBLOCK?#12 on sheet Management_RP2040; Manufacturer Part Number: NONE
U16 = XC7K160T-2FFG676I: as U16 on sheet FPGA_Power; Manufacturer Part Number: XC7K160T-2FFG676I

## Sheet FPGA_HPCC_B_DPs.SchDoc: FPGA Differential Pairs for HPCC B
size B; CheckedBy: Jason Sullins; Author: Jordan Harris-Toovy; Revision: 0.2; SheetNumber: 19; SheetTotal: 22; Size: ANSI B
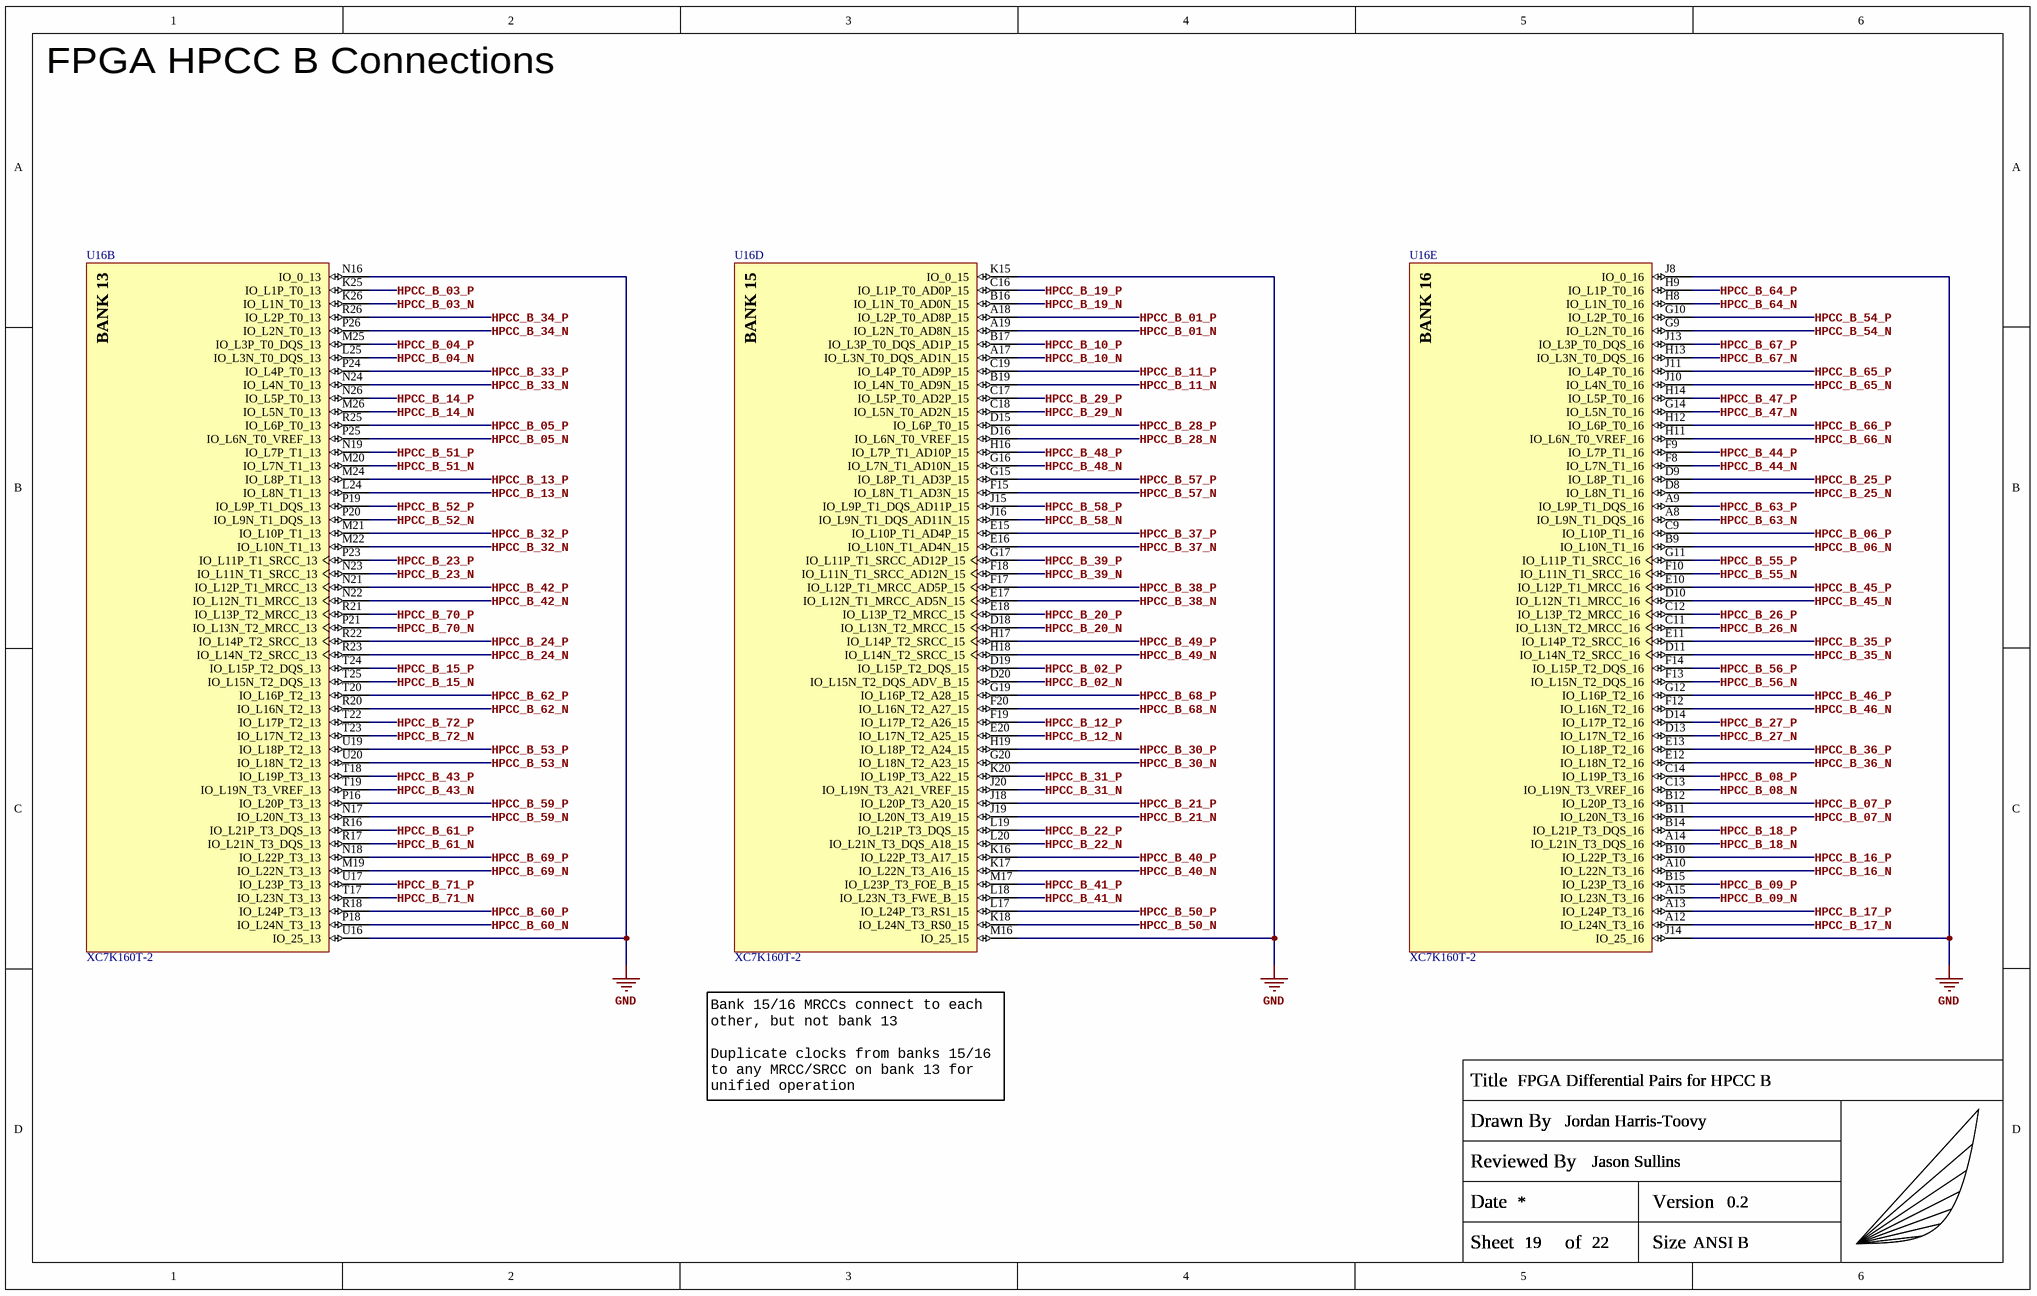
[diagram p15: FPGA_HPCC_B_DPs.SchDoc]

### Parts
(Parts that share a designator on the sheet are numbered #1, #2 ... from top to bottom, then left to right.)
TITLEBLOCK?#16  Capstone_Title_Block  (value not drawn)  (graphical)
U16  XC7K160T-2  [FFG676_(XC7K160T-2FFG676I)]  (parts B,D,E of 14)

### Nets
GND: U16.J8(IO_0_16) U16.J14(IO_25_16) U16.K15(IO_0_15) U16.M16(IO_25_15) U16.N16(IO_0_13) U16.U16(IO_25_13)
HPCC_B_01_N: U16.A19(IO_L2N_T0_AD8N_15)
HPCC_B_01_P: U16.A18(IO_L2P_T0_AD8P_15)
HPCC_B_02_N: U16.D20(IO_L15N_T2_DQS_ADV_B_15)
HPCC_B_02_P: U16.D19(IO_L15P_T2_DQS_15)
HPCC_B_03_N: U16.K26(IO_L1N_T0_13)
HPCC_B_03_P: U16.K25(IO_L1P_T0_13)
HPCC_B_04_N: U16.L25(IO_L3N_T0_DQS_13)
HPCC_B_04_P: U16.M25(IO_L3P_T0_DQS_13)
HPCC_B_05_N: U16.P25(IO_L6N_T0_VREF_13)
HPCC_B_05_P: U16.R25(IO_L6P_T0_13)
HPCC_B_06_N: U16.B9(IO_L10N_T1_16)
HPCC_B_06_P: U16.C9(IO_L10P_T1_16)
HPCC_B_07_N: U16.B11(IO_L20N_T3_16)
HPCC_B_07_P: U16.B12(IO_L20P_T3_16)
HPCC_B_08_N: U16.C13(IO_L19N_T3_VREF_16)
HPCC_B_08_P: U16.C14(IO_L19P_T3_16)
HPCC_B_09_N: U16.A15(IO_L23N_T3_16)
HPCC_B_09_P: U16.B15(IO_L23P_T3_16)
HPCC_B_10_N: U16.A17(IO_L3N_T0_DQS_AD1N_15)
HPCC_B_10_P: U16.B17(IO_L3P_T0_DQS_AD1P_15)
HPCC_B_11_N: U16.B19(IO_L4N_T0_AD9N_15)
HPCC_B_11_P: U16.C19(IO_L4P_T0_AD9P_15)
HPCC_B_12_N: U16.E20(IO_L17N_T2_A25_15)
HPCC_B_12_P: U16.F19(IO_L17P_T2_A26_15)
HPCC_B_13_N: U16.L24(IO_L8N_T1_13)
HPCC_B_13_P: U16.M24(IO_L8P_T1_13)
HPCC_B_14_N: U16.M26(IO_L5N_T0_13)
HPCC_B_14_P: U16.N26(IO_L5P_T0_13)
HPCC_B_15_N: U16.T25(IO_L15N_T2_DQS_13)
HPCC_B_15_P: U16.T24(IO_L15P_T2_DQS_13)
HPCC_B_16_N: U16.A10(IO_L22N_T3_16)
HPCC_B_16_P: U16.B10(IO_L22P_T3_16)
HPCC_B_17_N: U16.A12(IO_L24N_T3_16)
HPCC_B_17_P: U16.A13(IO_L24P_T3_16)
HPCC_B_18_N: U16.A14(IO_L21N_T3_DQS_16)
HPCC_B_18_P: U16.B14(IO_L21P_T3_DQS_16)
HPCC_B_19_N: U16.B16(IO_L1N_T0_AD0N_15)
HPCC_B_19_P: U16.C16(IO_L1P_T0_AD0P_15)
HPCC_B_20_N: U16.D18(IO_L13N_T2_MRCC_15)
HPCC_B_20_P: U16.E18(IO_L13P_T2_MRCC_15)
HPCC_B_21_N: U16.J19(IO_L20N_T3_A19_15)
HPCC_B_21_P: U16.J18(IO_L20P_T3_A20_15)
HPCC_B_22_N: U16.L20(IO_L21N_T3_DQS_A18_15)
HPCC_B_22_P: U16.L19(IO_L21P_T3_DQS_15)
HPCC_B_23_N: U16.N23(IO_L11N_T1_SRCC_13)
HPCC_B_23_P: U16.P23(IO_L11P_T1_SRCC_13)
HPCC_B_24_N: U16.R23(IO_L14N_T2_SRCC_13)
HPCC_B_24_P: U16.R22(IO_L14P_T2_SRCC_13)
HPCC_B_25_N: U16.D8(IO_L8N_T1_16)
HPCC_B_25_P: U16.D9(IO_L8P_T1_16)
HPCC_B_26_N: U16.C11(IO_L13N_T2_MRCC_16)
HPCC_B_26_P: U16.C12(IO_L13P_T2_MRCC_16)
HPCC_B_27_N: U16.D13(IO_L17N_T2_16)
HPCC_B_27_P: U16.D14(IO_L17P_T2_16)
HPCC_B_28_N: U16.D16(IO_L6N_T0_VREF_15)
HPCC_B_28_P: U16.D15(IO_L6P_T0_15)
HPCC_B_29_N: U16.C18(IO_L5N_T0_AD2N_15)
HPCC_B_29_P: U16.C17(IO_L5P_T0_AD2P_15)
HPCC_B_30_N: U16.G20(IO_L18N_T2_A23_15)
HPCC_B_30_P: U16.H19(IO_L18P_T2_A24_15)
HPCC_B_31_N: U16.J20(IO_L19N_T3_A21_VREF_15)
HPCC_B_31_P: U16.K20(IO_L19P_T3_A22_15)
HPCC_B_32_N: U16.M22(IO_L10N_T1_13)
HPCC_B_32_P: U16.M21(IO_L10P_T1_13)
HPCC_B_33_N: U16.N24(IO_L4N_T0_13)
HPCC_B_33_P: U16.P24(IO_L4P_T0_13)
HPCC_B_34_N: U16.P26(IO_L2N_T0_13)
HPCC_B_34_P: U16.R26(IO_L2P_T0_13)
HPCC_B_35_N: U16.D11(IO_L14N_T2_SRCC_16)
HPCC_B_35_P: U16.E11(IO_L14P_T2_SRCC_16)
HPCC_B_36_N: U16.E12(IO_L18N_T2_16)
HPCC_B_36_P: U16.E13(IO_L18P_T2_16)
HPCC_B_37_N: U16.E16(IO_L10N_T1_AD4N_15)
HPCC_B_37_P: U16.E15(IO_L10P_T1_AD4P_15)
HPCC_B_38_N: U16.E17(IO_L12N_T1_MRCC_AD5N_15)
HPCC_B_38_P: U16.F17(IO_L12P_T1_MRCC_AD5P_15)
HPCC_B_39_N: U16.F18(IO_L11N_T1_SRCC_AD12N_15)
HPCC_B_39_P: U16.G17(IO_L11P_T1_SRCC_AD12P_15)
HPCC_B_40_N: U16.K17(IO_L22N_T3_A16_15)
HPCC_B_40_P: U16.K16(IO_L22P_T3_A17_15)
HPCC_B_41_N: U16.L18(IO_L23N_T3_FWE_B_15)
HPCC_B_41_P: U16.M17(IO_L23P_T3_FOE_B_15)
HPCC_B_42_N: U16.N22(IO_L12N_T1_MRCC_13)
HPCC_B_42_P: U16.N21(IO_L12P_T1_MRCC_13)
HPCC_B_43_N: U16.T19(IO_L19N_T3_VREF_13)
HPCC_B_43_P: U16.T18(IO_L19P_T3_13)
HPCC_B_44_N: U16.F8(IO_L7N_T1_16)
HPCC_B_44_P: U16.F9(IO_L7P_T1_16)
HPCC_B_45_N: U16.D10(IO_L12N_T1_MRCC_16)
HPCC_B_45_P: U16.E10(IO_L12P_T1_MRCC_16)
HPCC_B_46_N: U16.F12(IO_L16N_T2_16)
HPCC_B_46_P: U16.G12(IO_L16P_T2_16)
HPCC_B_47_N: U16.G14(IO_L5N_T0_16)
HPCC_B_47_P: U16.H14(IO_L5P_T0_16)
HPCC_B_48_N: U16.G16(IO_L7N_T1_AD10N_15)
HPCC_B_48_P: U16.H16(IO_L7P_T1_AD10P_15)
HPCC_B_49_N: U16.H18(IO_L14N_T2_SRCC_15)
HPCC_B_49_P: U16.H17(IO_L14P_T2_SRCC_15)
HPCC_B_50_N: U16.K18(IO_L24N_T3_RS0_15)
HPCC_B_50_P: U16.L17(IO_L24P_T3_RS1_15)
HPCC_B_51_N: U16.M20(IO_L7N_T1_13)
HPCC_B_51_P: U16.N19(IO_L7P_T1_13)
HPCC_B_52_N: U16.P20(IO_L9N_T1_DQS_13)
HPCC_B_52_P: U16.P19(IO_L9P_T1_DQS_13)
HPCC_B_53_N: U16.U20(IO_L18N_T2_13)
HPCC_B_53_P: U16.U19(IO_L18P_T2_13)
HPCC_B_54_N: U16.G9(IO_L2N_T0_16)
HPCC_B_54_P: U16.G10(IO_L2P_T0_16)
HPCC_B_55_N: U16.F10(IO_L11N_T1_SRCC_16)
HPCC_B_55_P: U16.G11(IO_L11P_T1_SRCC_16)
HPCC_B_56_N: U16.F13(IO_L15N_T2_DQS_16)
HPCC_B_56_P: U16.F14(IO_L15P_T2_DQS_16)
HPCC_B_57_N: U16.F15(IO_L8N_T1_AD3N_15)
HPCC_B_57_P: U16.G15(IO_L8P_T1_AD3P_15)
HPCC_B_58_N: U16.J16(IO_L9N_T1_DQS_AD11N_15)
HPCC_B_58_P: U16.J15(IO_L9P_T1_DQS_AD11P_15)
HPCC_B_59_N: U16.N17(IO_L20N_T3_13)
HPCC_B_59_P: U16.P16(IO_L20P_T3_13)
HPCC_B_60_N: U16.P18(IO_L24N_T3_13)
HPCC_B_60_P: U16.R18(IO_L24P_T3_13)
HPCC_B_61_N: U16.R17(IO_L21N_T3_DQS_13)
HPCC_B_61_P: U16.R16(IO_L21P_T3_DQS_13)
HPCC_B_62_N: U16.R20(IO_L16N_T2_13)
HPCC_B_62_P: U16.T20(IO_L16P_T2_13)
HPCC_B_63_N: U16.A8(IO_L9N_T1_DQS_16)
HPCC_B_63_P: U16.A9(IO_L9P_T1_DQS_16)
HPCC_B_64_N: U16.H8(IO_L1N_T0_16)
HPCC_B_64_P: U16.H9(IO_L1P_T0_16)
HPCC_B_65_N: U16.J10(IO_L4N_T0_16)
HPCC_B_65_P: U16.J11(IO_L4P_T0_16)
HPCC_B_66_N: U16.H11(IO_L6N_T0_VREF_16)
HPCC_B_66_P: U16.H12(IO_L6P_T0_16)
HPCC_B_67_N: U16.H13(IO_L3N_T0_DQS_16)
HPCC_B_67_P: U16.J13(IO_L3P_T0_DQS_16)
HPCC_B_68_N: U16.F20(IO_L16N_T2_A27_15)
HPCC_B_68_P: U16.G19(IO_L16P_T2_A28_15)
HPCC_B_69_N: U16.M19(IO_L22N_T3_13)
HPCC_B_69_P: U16.N18(IO_L22P_T3_13)
HPCC_B_70_N: U16.P21(IO_L13N_T2_MRCC_13)
HPCC_B_70_P: U16.R21(IO_L13P_T2_MRCC_13)
HPCC_B_71_N: U16.T17(IO_L23N_T3_13)
HPCC_B_71_P: U16.U17(IO_L23P_T3_13)
HPCC_B_72_N: U16.T23(IO_L17N_T2_13)
HPCC_B_72_P: U16.T22(IO_L17P_T2_13)

### Notes on the sheet
- FPGA HPCC B Connections
- Bank 15/16 MRCCs connect to each other, but not bank 13
  Duplicate clocks from banks 15/16 to any MRCC/SRCC on bank 13 for unified operation
- (in symbol Capstone_Title_Block) Title; Drawn By; Reviewed By; Date; Version; Sheet; of; Size
- (in symbol XC7K160T-2FFG676I, part B) BANK 13
- (in symbol XC7K160T-2FFG676I, part D) BANK 15
- (in symbol XC7K160T-2FFG676I, part E) BANK 16

### Library data of the parts
TITLEBLOCK?#16 = Capstone_Title_Block: as TITLEBLOCK?#12 on sheet Management_RP2040; Manufacturer Part Number: NONE
U16 = XC7K160T-2FFG676I: as U16 on sheet FPGA_Power; Manufacturer Part Number: XC7K160T-2FFG676I

## Sheet FPGA_GTXs.SchDoc: FPGA GTX Transceivers & SFP Clock
size B; CheckedBy: Jason Sullins; Author: Jordan Harris-Toovy; Revision: 0.2; SheetNumber: 20; SheetTotal: 22; Size: ANSI B
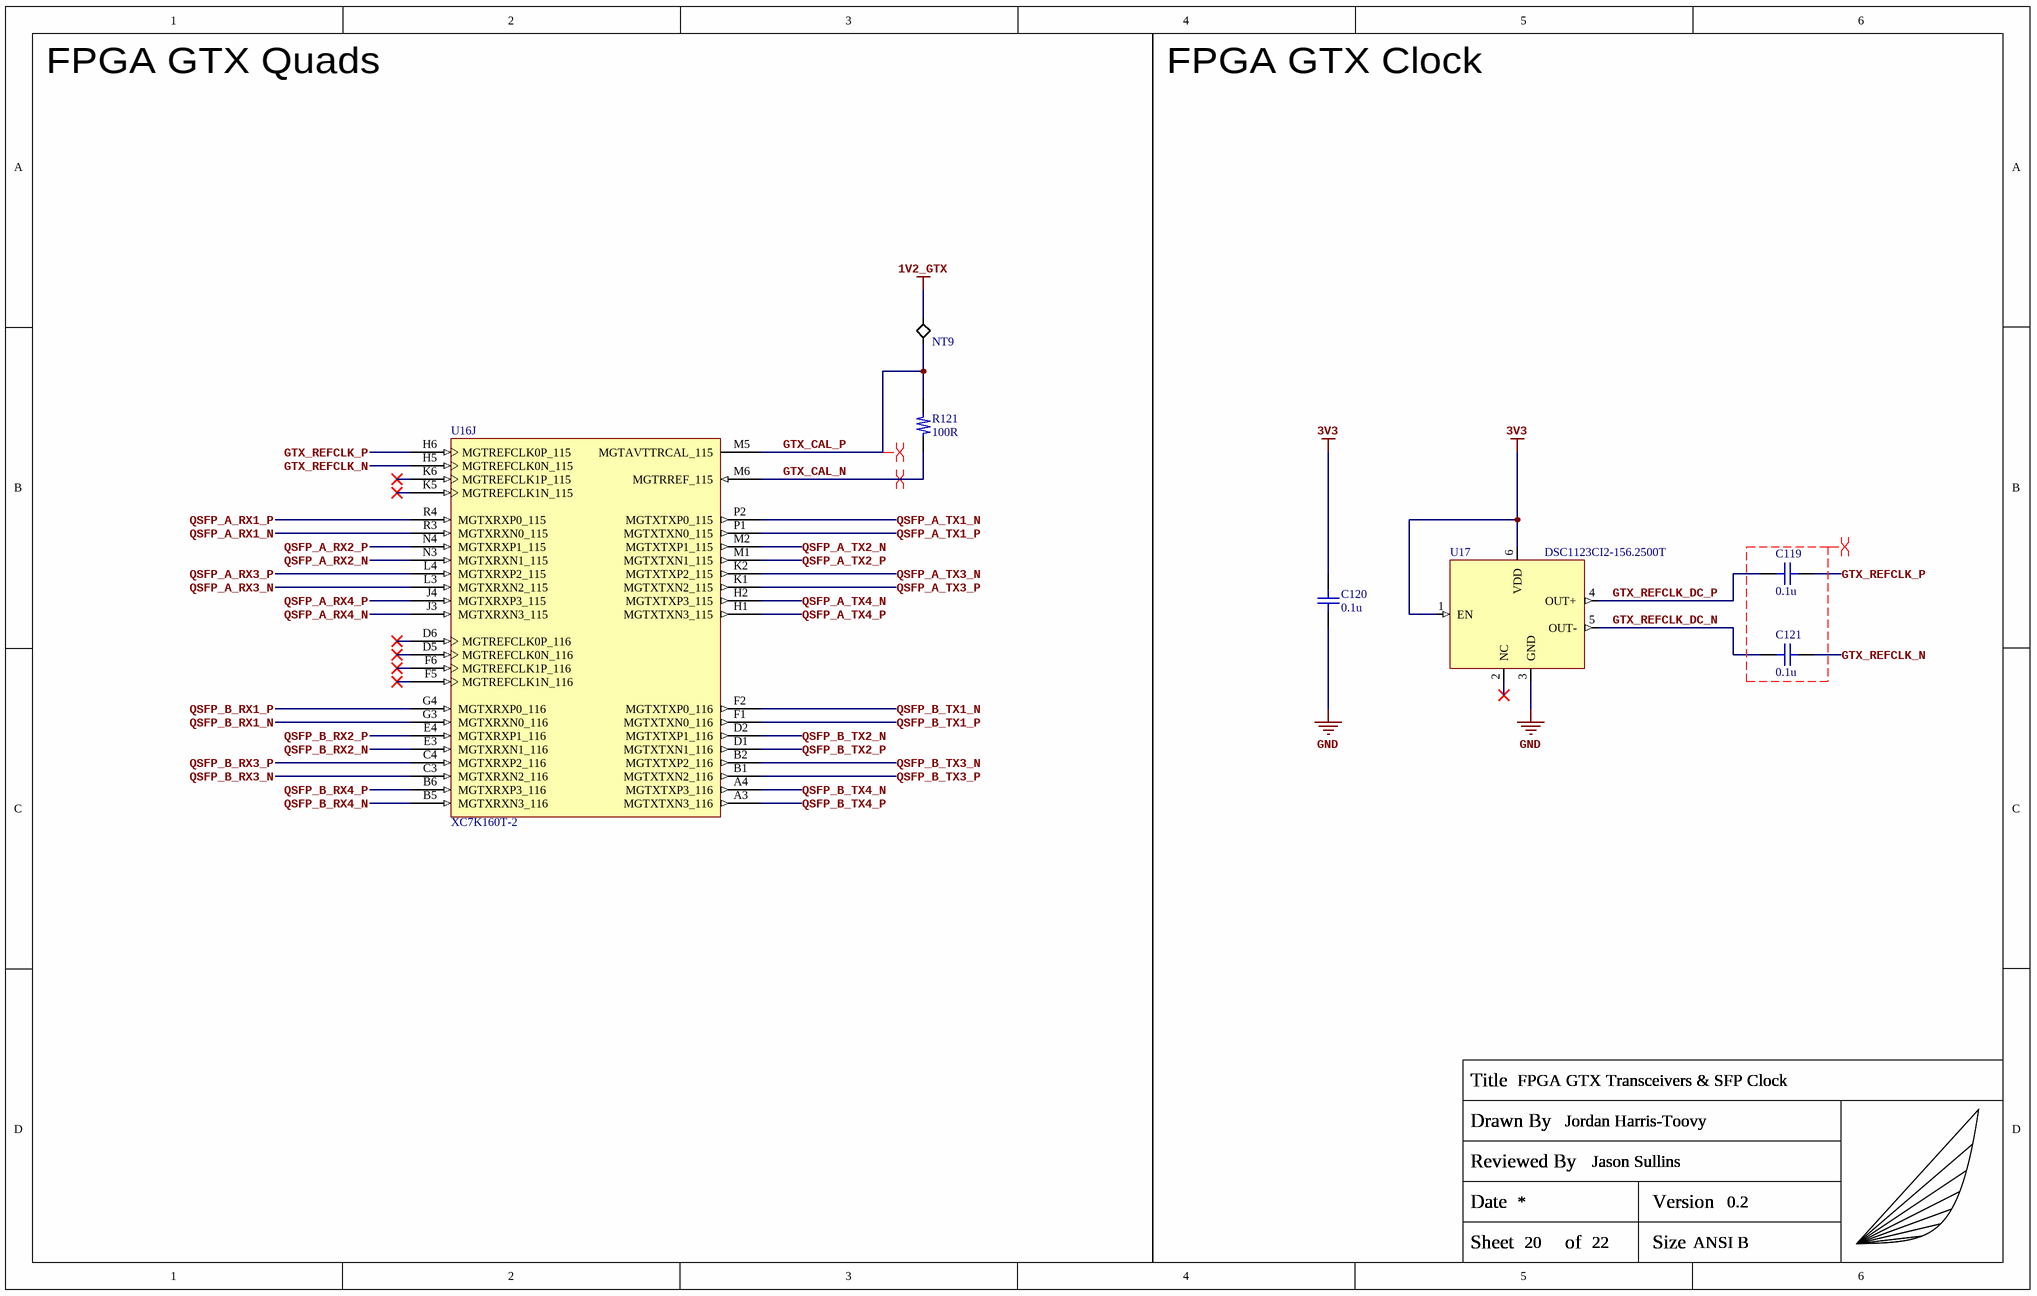
[diagram p16: FPGA_GTXs.SchDoc]

### Parts
(Parts that share a designator on the sheet are numbered #1, #2 ... from top to bottom, then left to right.)
C119  0.1u  [C_0402_Generic]
C120  0.1u  [C_0402_Generic]
C121  0.1u  [C_0402_Generic]
NT9  NT  [SMD_NET_TIE]  (value not drawn)  (net tie, no BOM)
R121  100R  [R_0402_Generic]
TITLEBLOCK?#17  Capstone_Title_Block  (value not drawn)  (graphical)
U16  XC7K160T-2  [FFG676_(XC7K160T-2FFG676I)]  (part J of 14)
U17  DSC1123CI2-156.2500T  [Microchip_DSC1123CI2]

### Nets
1V2_GTX: NT9.2(P2)
3V3: C120.1 U17.1(EN) U17.6(VDD)
GND: C120.2 U17.3(GND)
GTX_CAL_N: R121.1 U16.M6(MGTRREF_115)
GTX_CAL_P: NT9.1(P1) R121.2 U16.M5(MGTAVTTRCAL_115)
GTX_REFCLK_DC_N: C121.2 U17.5(OUT-)
GTX_REFCLK_DC_P: C119.2 U17.4(OUT+)
GTX_REFCLK_N: C121.1 U16.H5(MGTREFCLK0N_115)
GTX_REFCLK_P: C119.1 U16.H6(MGTREFCLK0P_115)
QSFP_A_RX1_N: U16.R3(MGTXRXN0_115)
QSFP_A_RX1_P: U16.R4(MGTXRXP0_115)
QSFP_A_RX2_N: U16.N3(MGTXRXN1_115)
QSFP_A_RX2_P: U16.N4(MGTXRXP1_115)
QSFP_A_RX3_N: U16.L3(MGTXRXN2_115)
QSFP_A_RX3_P: U16.L4(MGTXRXP2_115)
QSFP_A_RX4_N: U16.J3(MGTXRXN3_115)
QSFP_A_RX4_P: U16.J4(MGTXRXP3_115)
QSFP_A_TX1_N: U16.P2(MGTXTXP0_115)
QSFP_A_TX1_P: U16.P1(MGTXTXN0_115)
QSFP_A_TX2_N: U16.M2(MGTXTXP1_115)
QSFP_A_TX2_P: U16.M1(MGTXTXN1_115)
QSFP_A_TX3_N: U16.K2(MGTXTXP2_115)
QSFP_A_TX3_P: U16.K1(MGTXTXN2_115)
QSFP_A_TX4_N: U16.H2(MGTXTXP3_115)
QSFP_A_TX4_P: U16.H1(MGTXTXN3_115)
QSFP_B_RX1_N: U16.G3(MGTXRXN0_116)
QSFP_B_RX1_P: U16.G4(MGTXRXP0_116)
QSFP_B_RX2_N: U16.E3(MGTXRXN1_116)
QSFP_B_RX2_P: U16.E4(MGTXRXP1_116)
QSFP_B_RX3_N: U16.C3(MGTXRXN2_116)
QSFP_B_RX3_P: U16.C4(MGTXRXP2_116)
QSFP_B_RX4_N: U16.B5(MGTXRXN3_116)
QSFP_B_RX4_P: U16.B6(MGTXRXP3_116)
QSFP_B_TX1_N: U16.F2(MGTXTXP0_116)
QSFP_B_TX1_P: U16.F1(MGTXTXN0_116)
QSFP_B_TX2_N: U16.D2(MGTXTXP1_116)
QSFP_B_TX2_P: U16.D1(MGTXTXN1_116)
QSFP_B_TX3_N: U16.B2(MGTXTXP2_116)
QSFP_B_TX3_P: U16.B1(MGTXTXN2_116)
QSFP_B_TX4_N: U16.A4(MGTXTXP3_116)
QSFP_B_TX4_P: U16.A3(MGTXTXN3_116)

Not connected (* = marked no-connect by the designer): U16 D5(MGTREFCLK0N_116)* D6(MGTREFCLK0P_116)* F5(MGTREFCLK1N_116)* F6(MGTREFCLK1P_116)* K5(MGTREFCLK1N_115)* K6(MGTREFCLK1P_115)*; U17 2(NC)*

### Layout directives
differential pair; differential pair class DP100_GENERAL: (no net found under the mark), GTX_CAL_N, GTX_CAL_P

### Notes on the sheet
- FPGA GTX Quads
- FPGA GTX Clock
- (in symbol Capstone_Title_Block) Title; Drawn By; Reviewed By; Date; Version; Sheet; of; Size

### Library data of the parts
C119-C121 = GRM155R71C104KA88D: as C1 on sheet Management_RP2040; Manufacturer Part Number: GRM155R71C104KA88D
NT9 = Net_Tie_SMD: SMD Net Tie; Manufacturer: NONE; Manufacturer Part Number: NONE
R121 = ERJ-2RHD1000X: 100Ohm 0.5% 1/16W SMD resistor in 0402 size; Manufacturer: Panasonic; Manufacturer Part Number: ERJ-2RHD1000X
TITLEBLOCK?#17 = Capstone_Title_Block: as TITLEBLOCK?#12 on sheet Management_RP2040; Manufacturer Part Number: NONE
U16 = XC7K160T-2FFG676I: as U16 on sheet FPGA_Power; Manufacturer Part Number: XC7K160T-2FFG676I
U17 = DSC1123CI2-156.2500T: MEMS OSC XO 156.2500MHZ LVDS SMD; Manufacturer: Microchip Technology; Manufacturer Part Number: DSC1123CI2-156.2500T

## Sheet Power_Input_Indicators.SchDoc: Power Inputs and Indicators
size B; CheckedBy: Jason Sullins; Author: Jordan Harris-Toovy; Revision: 0.2; SheetNumber: 4; SheetTotal: 22; Size: ANSI B
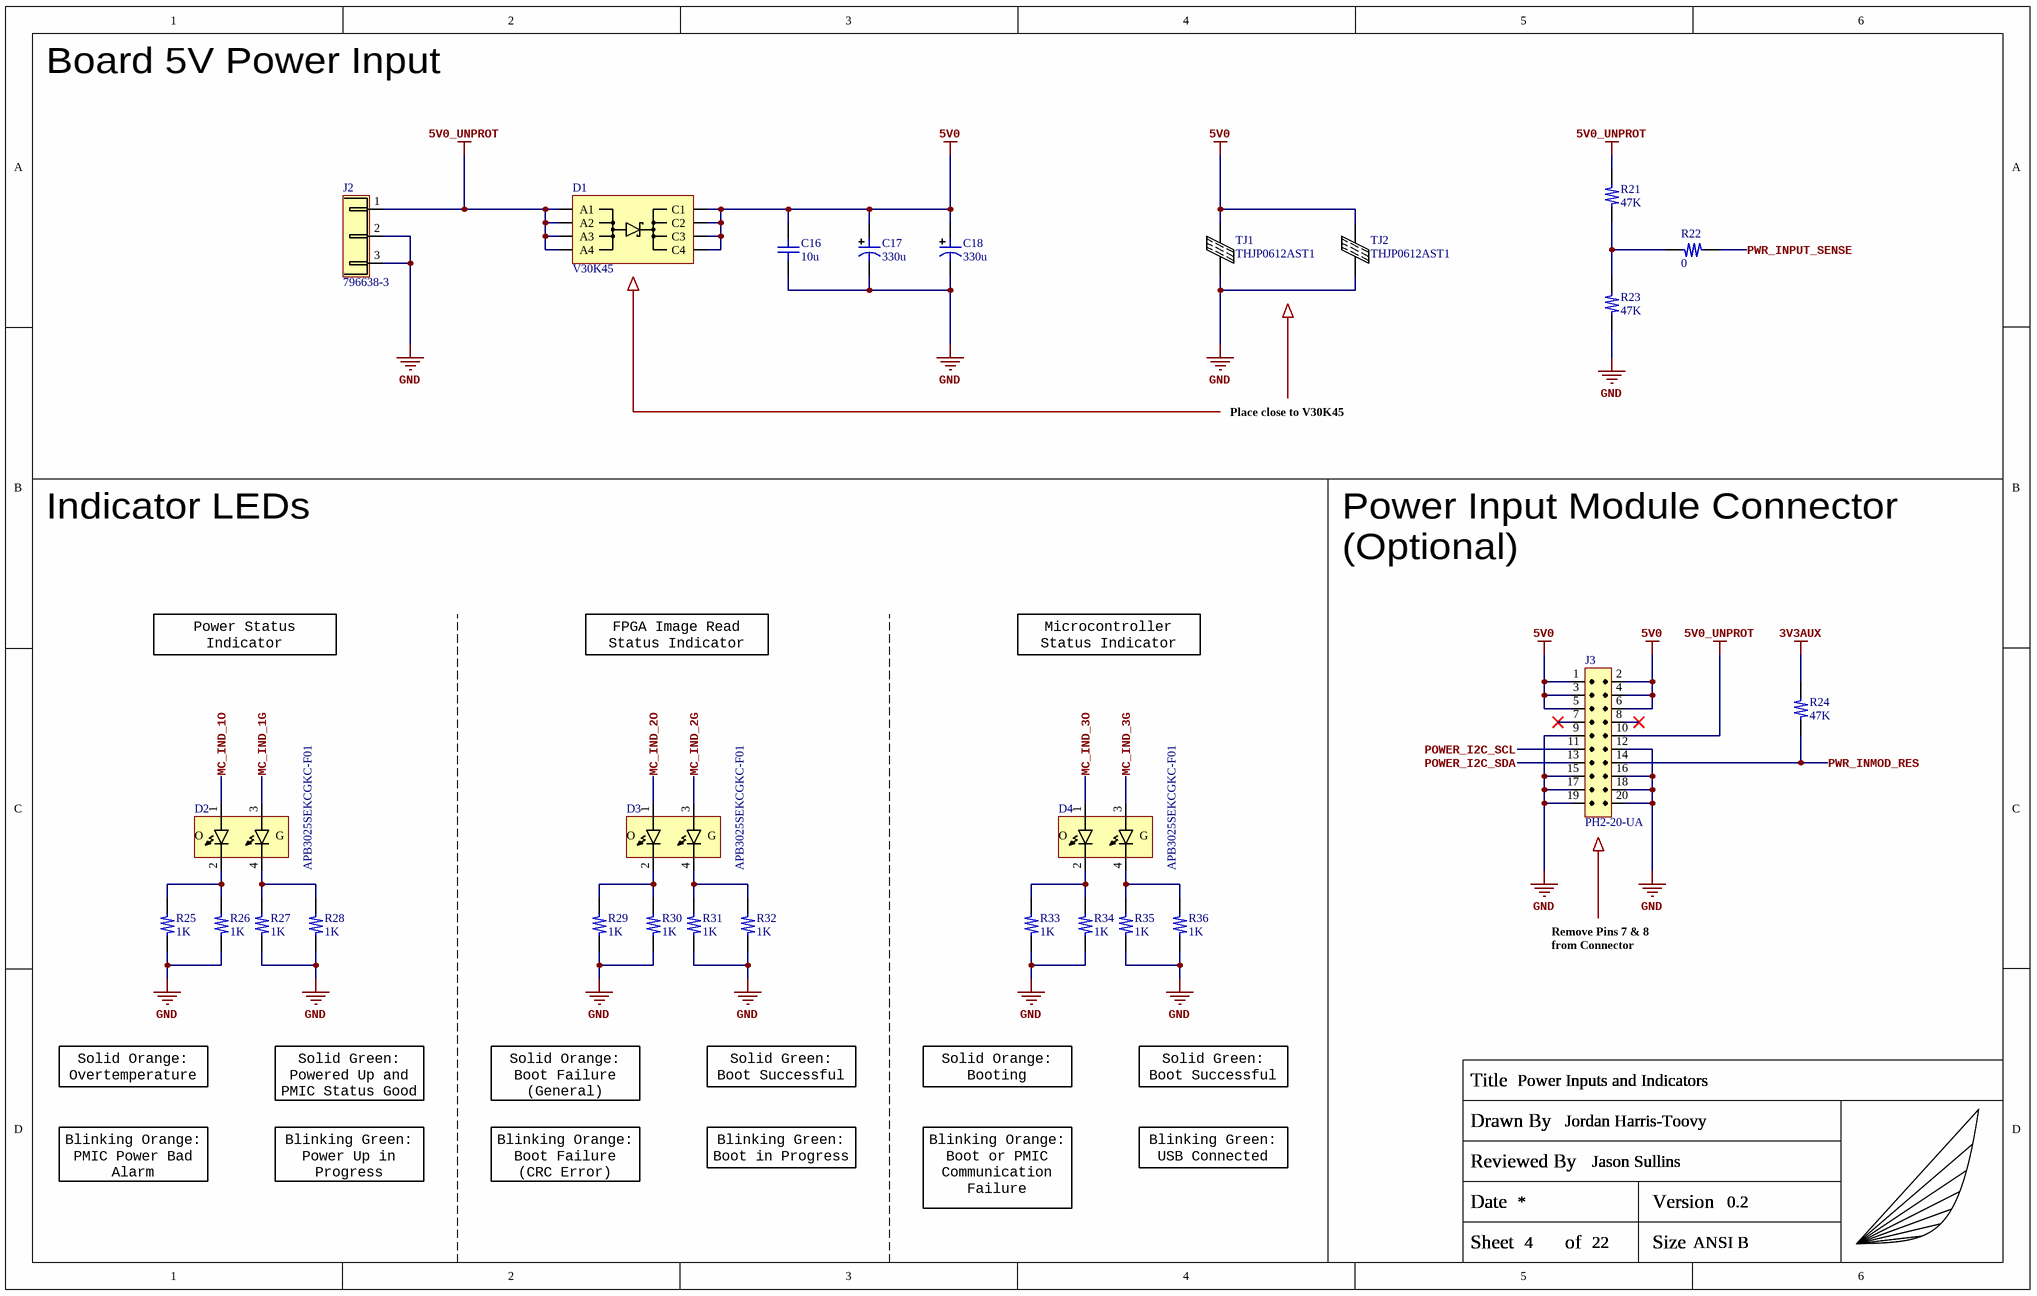
[diagram p17: Power_Input_Indicators.SchDoc]

### Parts
(Parts that share a designator on the sheet are numbered #1, #2 ... from top to bottom, then left to right.)
C16  10u  [C_0402_Generic]
C17  330u  [KEMET_EK_Radial]
C18  330u  [KEMET_EK_Radial]
D1  V30K45  [Vishay_FlatPAK_5x6]
D2  APB3025SEKCGKC-F01  [KINGBRIGHT_1210_DUAL]
D3  APB3025SEKCGKC-F01  [KINGBRIGHT_1210_DUAL]
D4  APB3025SEKCGKC-F01  [KINGBRIGHT_1210_DUAL]
J2  796638-3  [TE_796638-3]
J3  PH2-20-UA  [ADAM_TECH_PH2-20-UA]
R21  47K  [R_0402_Generic]
R22  0  [R_0402_Generic]
R23  47K  [R_0402_Generic]
R24  47K  [R_0402_Generic]
R25  1K  [R_0402_Generic]
R26  1K  [R_0402_Generic]
R27  1K  [R_0402_Generic]
R28  1K  [R_0402_Generic]
R29  1K  [R_0402_Generic]
R30  1K  [R_0402_Generic]
R31  1K  [R_0402_Generic]
R32  1K  [R_0402_Generic]
R33  1K  [R_0402_Generic]
R34  1K  [R_0402_Generic]
R35  1K  [R_0402_Generic]
R36  1K  [R_0402_Generic]
TITLEBLOCK?#18  Capstone_Title_Block  (value not drawn)  (graphical)
TJ1  THJP0612AST1  [ThermaWick_0612]
TJ2  THJP0612AST1  [ThermaWick_0612]

### Nets
3V3AUX: R24.2
5V0: C16.2 C17.1 C18.1 D1.5(C1) D1.6(C2) D1.7(C3) D1.8(C4) J3.1(P1) J3.2(P2) J3.3(P3) J3.4(P4) J3.5(P5) J3.6(P6) TJ1.2(P2) TJ2.2(P2)
5V0_UNPROT: D1.1(A1) D1.2(A2) D1.3(A3) D1.4(A4) J2.1(P1) J3.10(P10) R21.2
GND: C16.1 C17.2 C18.2 J2.2(P2) J2.3(P3) J3.9(P9) J3.12(P12) J3.15(P15) J3.16(P16) J3.17(P17) J3.18(P18) J3.19(P19) J3.20(P20) R23.1 R25.1 R26.1 R27.1 R28.1 R29.1 R30.1 R31.1 R32.1 R33.1 R34.1 R35.1 R36.1 TJ1.1(P1) TJ2.1(P1)
MC_IND_1G: D2.3(A2)
MC_IND_1O: D2.1(A1)
MC_IND_2G: D3.3(A2)
MC_IND_2O: D3.1(A1)
MC_IND_3G: D4.3(A2)
MC_IND_3O: D4.1(A1)
POWER_I2C_SCL: J3.11(P11)
POWER_I2C_SDA: J3.13(P13)
PWR_INMOD_RES: J3.14(P14) R24.1
PWR_INPUT_SENSE: R22.1
NetD2_2: D2.2(C1) R25.2 R26.2
NetD2_4: D2.4(C2) R27.2 R28.2
NetD3_2: D3.2(C1) R29.2 R30.2
NetD3_4: D3.4(C2) R31.2 R32.2
NetD4_2: D4.2(C1) R33.2 R34.2
NetD4_4: D4.4(C2) R35.2 R36.2
NetR21_1: R21.1 R22.2 R23.2

Not connected (* = marked no-connect by the designer): J3 7(P7)* 8(P8)*

### Notes on the sheet
- Board 5V Power Input
- Place close to V30K45
- Indicator LEDs
- Power Input Module Connector
- (Optional)
- Power Status Indicator
- FPGA Image Read Status Indicator
- Microcontroller Status Indicator
- Remove Pins 7 & 8
- from Connector
- Solid Orange: Overtemperature
- Solid Green: Powered Up and PMIC Status Good
- Solid Orange: Boot Failure (General)
- Solid Green: Boot Successful
- Solid Orange: Booting
- Blinking Orange: PMIC Power Bad Alarm
- Blinking Green: Power Up in Progress
- Blinking Orange: Boot Failure (CRC Error)
- Blinking Green: Boot in Progress
- Blinking Green: USB Connected
- Blinking Orange: Boot or PMIC Communication Failure
- (in symbol APB3025SEKCGKC-F01) O; G
- (in symbol Capstone_Title_Block) Title; Drawn By; Reviewed By; Date; Version; Sheet; of; Size

### Library data of the parts
C16 = CC0402MRX5R6BB106: as C12 on sheet Management_RP2040; Manufacturer Part Number: CC0402MRX5R6BB106
C17 C18 = A759EK337M1AAAE018: 330µF 10V Aluminum polymer capacitor, KEMET EK; Manufacturer: KEMET; Manufacturer Part Number: A759EK337M1AAAE018
D1 = V30K45-M3/H: Schottky Diode 45V 30A FLATPAK, Vishay; Manufacturer: Vishay General Semiconductor; Manufacturer Part Number: V30K45-M3/H
D2-D4 = APB3025SEKCGKC-F01: LED 1210 Green/Orange dual 2.1Vf 160deg 60/300 mcd@20mA; Manufacturer: Kingbright; Manufacturer Part Number: APB3025SEKCGKC-F01
J2 = 796638-3: 3 Position Terminal Block Header, Male Pins, Shrouded / NOTE: Mating wire-to-pin socket is 796635-3; Manufacturer: TE Connectivity; Manufacturer Part Number: 796638-3; Manufacturer2: TE Connectivity; Manufacturer2 Part Number: 796635-3
J3 = PH2-20-UA: THT Header 20 (2x10) position 0.1"; Manufacturer: Adam Tech; Manufacturer Part Number: PH2-20-UA
R21 R23 R24 = ERJ-2RKF4702X: 47KOhm 1% 1/10W SMD resistor in 0402 size; Manufacturer: Panasonic; Manufacturer Part Number: ERJ-2RKF4702X
R22 = ERJ-2GE0R00X: Jumper 0Ohm SMD resistor in 0402 size; Manufacturer: Panasonic; Manufacturer Part Number: ERJ-2GE0R00X
R25-R36 = ERJ-2RKF1001X: 1KOhm 1% 1/10W SMD resistor in 0402 size; Manufacturer: Panasonic; Manufacturer Part Number: ERJ-2RKF1001X
TITLEBLOCK?#18 = Capstone_Title_Block: as TITLEBLOCK?#12 on sheet Management_RP2040; Manufacturer Part Number: NONE
TJ1 TJ2 = THJP0612AST1: ThermaWick Thermal Jumper 0612; Manufacturer: Vishay Dale; Manufacturer Part Number: THJP0612AST1

## Sheet Miscellaneous_Functions.SchDoc: Miscellaneous Functions & Programming
size B; CheckedBy: Jason Sullins; Author: Jordan Harris-Toovy; Revision: 0.2; SheetNumber: 22; SheetTotal: 22; Size: ANSI B
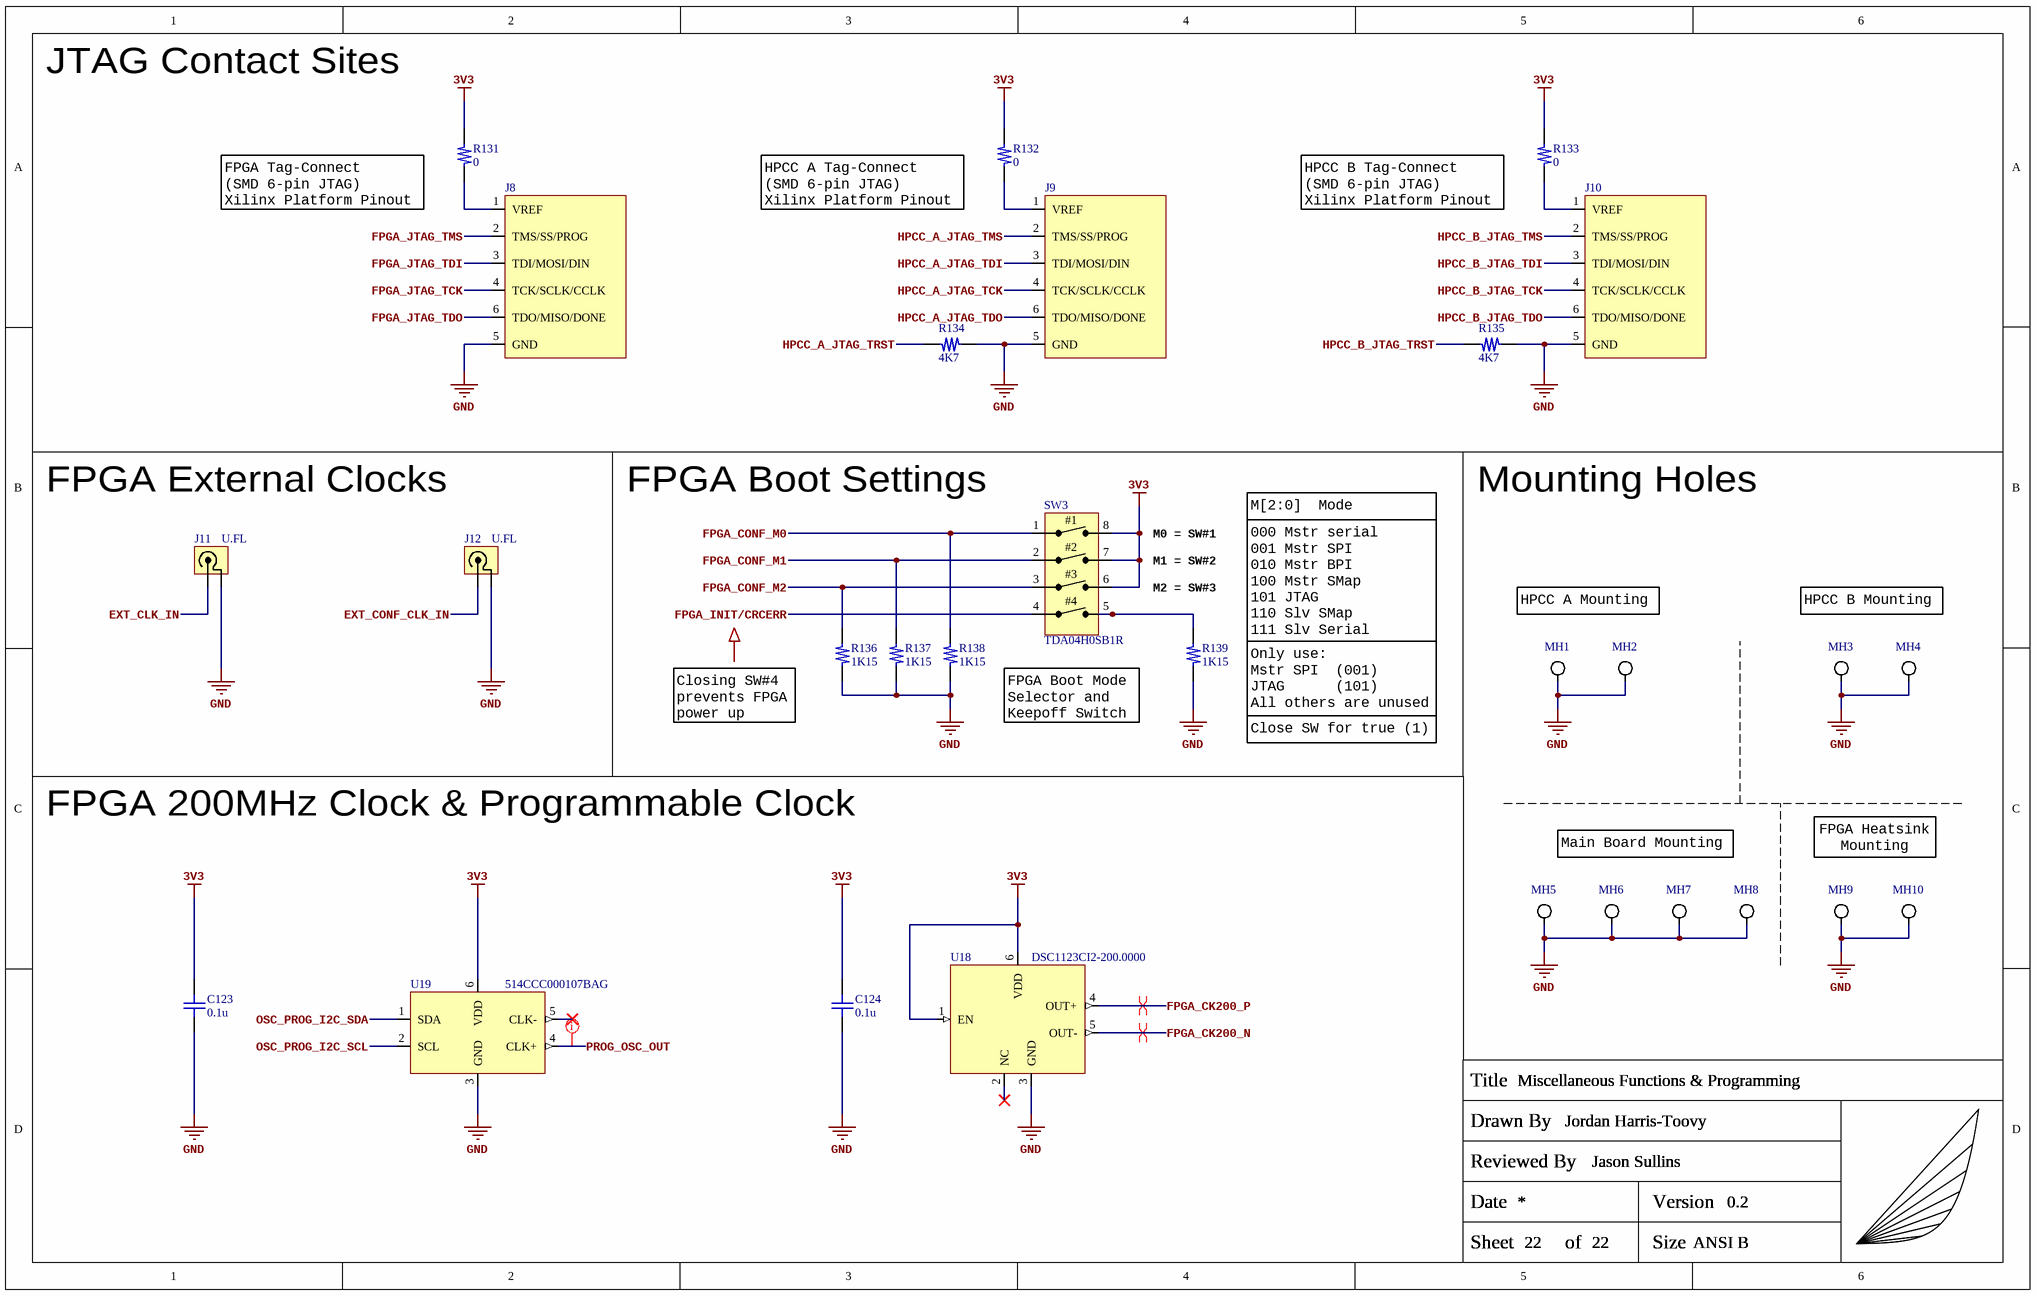
[diagram p18: Miscellaneous_Functions.SchDoc]

### Parts
(Parts that share a designator on the sheet are numbered #1, #2 ... from top to bottom, then left to right.)
C123  0.1u  [C_0402_Generic]
C124  0.1u  [C_0402_Generic]
J8  TC-XILINX6_6PIN  [TAG-CONNECT_NO-LEGS_6PIN]  (value not drawn)
J9  TC-XILINX6_6PIN  [TAG-CONNECT_NO-LEGS_6PIN]  (value not drawn)
J10  TC-XILINX6_6PIN  [TAG-CONNECT_NO-LEGS_6PIN]  (value not drawn)
J11  U.FL  [TE_IPEX]
J12  U.FL  [TE_IPEX]
MH1  M2.5 Mounting Hole  [M2.5_MOUNTING_HOLE]  (value not drawn)
MH2  M2.5 Mounting Hole  [M2.5_MOUNTING_HOLE]  (value not drawn)
MH3  M2.5 Mounting Hole  [M2.5_MOUNTING_HOLE]  (value not drawn)
MH4  M2.5 Mounting Hole  [M2.5_MOUNTING_HOLE]  (value not drawn)
MH5  M2.5 Mounting Hole  [M2.5_MOUNTING_HOLE]  (value not drawn)
MH6  M2.5 Mounting Hole  [M2.5_MOUNTING_HOLE]  (value not drawn)
MH7  M2.5 Mounting Hole  [M2.5_MOUNTING_HOLE]  (value not drawn)
MH8  M2.5 Mounting Hole  [M2.5_MOUNTING_HOLE]  (value not drawn)
MH9  M2.5 Mounting Hole  [M2.5_MOUNTING_HOLE]  (value not drawn)
MH10  M2.5 Mounting Hole  [M2.5_MOUNTING_HOLE]  (value not drawn)
R131  0  [R_0402_Generic]
R132  0  [R_0402_Generic]
R133  0  [R_0402_Generic]
R134  4K7  [R_0402_Generic]
R135  4K7  [R_0402_Generic]
R136  1K15  [R_0402_Generic]
R137  1K15  [R_0402_Generic]
R138  1K15  [R_0402_Generic]
R139  1K15  [R_0402_Generic]
SW3  TDA04H0SB1R  [C&K_TDA_GULL_04POS]
TITLEBLOCK?#19  Capstone_Title_Block  (value not drawn)  (graphical)
U18  DSC1123CI2-200.0000  [Microchip_DSC1123CI2]
U19  514CCC000107BAG  [Si514_Size-B]

### Nets
3V3: C123.2 C124.2 R131.2 R132.2 R133.2 SW3.6(2C) SW3.7(2B) SW3.8(2A) U18.1(EN) U18.6(VDD) U19.6(VDD)
GND: C123.1 C124.1 J8.5(GND) J9.5(GND) J10.5(GND) J11.2(GND) J12.2(GND) MH1.0 MH2.0 MH3.0 MH4.0 MH5.0 MH6.0 MH7.0 MH8.0 MH9.0 MH10.0 R134.1 R135.1 R136.1 R137.1 R138.1 R139.1 U18.3(GND) U19.3(GND)
EXT_CLK_IN: J11.1(RF)
EXT_CONF_CLK_IN: J12.1(RF)
FPGA_CK200_N: U18.5(OUT-)
FPGA_CK200_P: U18.4(OUT+)
FPGA_CONF_M0: R138.2 SW3.1(1A)
FPGA_CONF_M1: R137.2 SW3.2(1B)
FPGA_CONF_M2: R136.2 SW3.3(1C)
FPGA_INIT/CRCERR: SW3.4(1D)
FPGA_JTAG_TCK: J8.4(TCK/SCLK/CCLK)
FPGA_JTAG_TDI: J8.3(TDI/MOSI/DIN)
FPGA_JTAG_TDO: J8.6(TDO/MISO/DONE)
FPGA_JTAG_TMS: J8.2(TMS/SS/PROG)
HPCC_A_JTAG_TCK: J9.4(TCK/SCLK/CCLK)
HPCC_A_JTAG_TDI: J9.3(TDI/MOSI/DIN)
HPCC_A_JTAG_TDO: J9.6(TDO/MISO/DONE)
HPCC_A_JTAG_TMS: J9.2(TMS/SS/PROG)
HPCC_A_JTAG_TRST: R134.2
HPCC_B_JTAG_TCK: J10.4(TCK/SCLK/CCLK)
HPCC_B_JTAG_TDI: J10.3(TDI/MOSI/DIN)
HPCC_B_JTAG_TDO: J10.6(TDO/MISO/DONE)
HPCC_B_JTAG_TMS: J10.2(TMS/SS/PROG)
HPCC_B_JTAG_TRST: R135.2
OSC_PROG_I2C_SCL: U19.2(SCL)
OSC_PROG_I2C_SDA: U19.1(SDA)
PROG_OSC_OUT: U19.4(CLK+)
NetJ8_1: J8.1(VREF) R131.1
NetJ9_1: J9.1(VREF) R132.1
NetJ10_1: J10.1(VREF) R133.1
NetR139_2: R139.2 SW3.5(2D)

Not connected (* = marked no-connect by the designer): U18 2(NC)*; U19 5(CLK-)*

### Layout directives
net class SE50_GENERAL: PROG_OSC_OUT
differential pair; differential pair class DP100_GENERAL: FPGA_CK200_N, FPGA_CK200_P

### Notes on the sheet
- JTAG Contact Sites
- (near R131) FPGA Tag-Connect
  (SMD 6-pin JTAG)
  Xilinx Platform Pinout
- (near R132) HPCC A Tag-Connect
  (SMD 6-pin JTAG)
  Xilinx Platform Pinout
- (near R133) HPCC B Tag-Connect
  (SMD 6-pin JTAG)
  Xilinx Platform Pinout
- FPGA External Clocks
- FPGA Boot Settings
- Mounting Holes
- M1 = SW#2
- M0 = SW#1
- M[2:0]  Mode
- M2 = SW#3
- 000	Mstr serial
  001	Mstr SPI
  010	Mstr BPI
  100	Mstr SMap
  101	JTAG
  110	Slv SMap
  111	Slv Serial
- HPCC A Mounting
- HPCC B Mounting
- (near R136) Closing SW#4 prevents FPGA power up
- FPGA Boot Mode Selector and Keepoff Switch
- Only use:
  Mstr SPI  (001)
  JTAG      (101)
  All others are unused
- Close SW for true (1)
- FPGA 200MHz Clock & Programmable Clock
- Main Board Mounting
- FPGA Heatsink Mounting
- (in symbol Capstone_Title_Block) Title; Drawn By; Reviewed By; Date; Version; Sheet; of; Size
- (in symbol TDA04H0SB1R) #1; #2; #3; #4

### Library data of the parts
C123 C124 = GRM155R71C104KA88D: as C1 on sheet Management_RP2040; Manufacturer Part Number: GRM155R71C104KA88D
J8-J10 = TC-XILINX6_6PIN: 6-pin (legless) Xilinx JTAG Tag-Connect site; Manufacturer: NONE; Manufacturer2 Part Number: TC2030-IDC-NL; Manufacturer Part Number: NONE; Manufacturer2: Tag-Connect
J11 J12 = CONUFL001-SMD-T: U.FL (UMCC) Connector, SMD, 50Ohm; Manufacturer: TE Connectivity; Manufacturer Part Number: CONUFL001-SMD-T
MH1-MH10 = M2.5 Mounting Hole: M.2 Mounting hole; Manufacturer: NONE; Manufacturer Part Number: NONE
R131-R133 = ERJ-2GE0R00X: as R22 on sheet Power_Input_Indicators; Manufacturer Part Number: ERJ-2GE0R00X
R134 R135 = ERJ-2RKF4701X: as R1-R3 on sheet Management_RP2040; Manufacturer Part Number: ERJ-2RKF4701X
R136-R139 = ERJ-2RKF1151X: as R6 on sheet Management_RP2040; Manufacturer Part Number: ERJ-2RKF1151X
SW3 = TDA04H0SB1R: Dip Switch SPST 4 Position 25mA 24VDC; Manufacturer: C&K; Manufacturer Part Number: TDA04H0SB1R
TITLEBLOCK?#19 = Capstone_Title_Block: as TITLEBLOCK?#12 on sheet Management_RP2040; Manufacturer Part Number: NONE
U18 = DSC1123CI2-200.0000: MEMS OSC XO 200.0000MHZ LVDS SMD; Manufacturer: Microchip Technology; Manufacturer Part Number: DSC1123CI2-200.0000
U19 = 514CCC000107BAG: I2C Programmable oscillator differential/single-ended 0.1-125 MHz; Manufacturer: Skyworks Solutions; Manufacturer Part Number: 514CCC000107BAG

## Sheet PMIC_GTXs.SchDoc: GTX Power Supplies
size B; CheckedBy: Jason Sullins; Author: Jordan Harris-Toovy; Revision: 0.2; SheetNumber: 14; SheetTotal: 22; Size: ANSI B
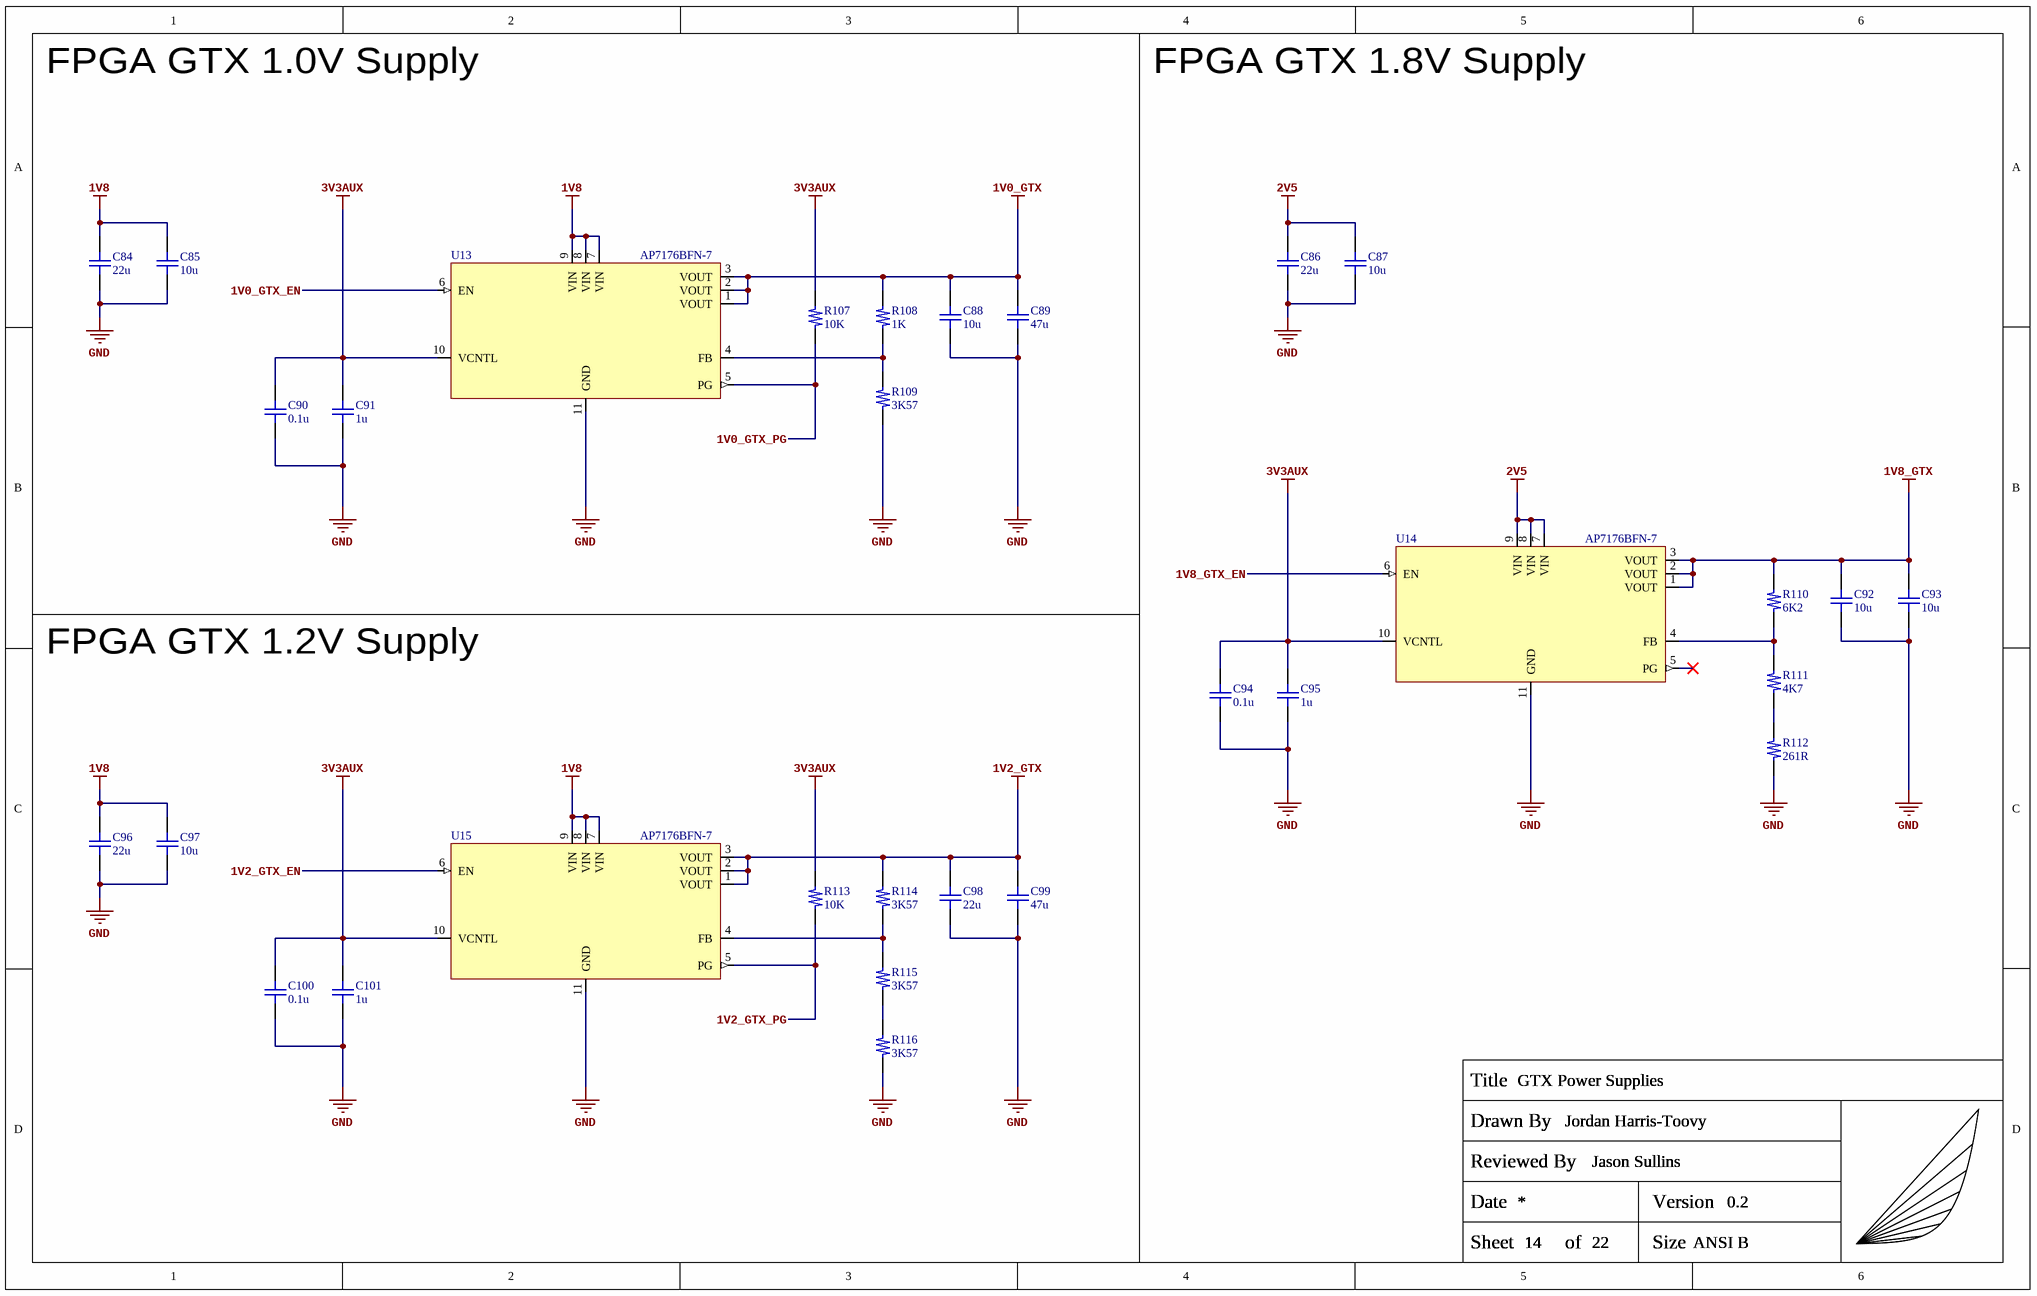
[diagram p19: PMIC_GTXs.SchDoc]

### Parts
(Parts that share a designator on the sheet are numbered #1, #2 ... from top to bottom, then left to right.)
C84  22u  [C_0603_Generic]
C85  10u  [C_0402_Generic]
C86  22u  [C_0603_Generic]
C87  10u  [C_0402_Generic]
C88  10u  [C_0402_Generic]
C89  47u  [C_0603_Generic]
C90  0.1u  [C_0402_Generic]
C91  1u  [C_0402_Generic]
C92  10u  [C_0402_Generic]
C93  10u  [C_0402_Generic]
C94  0.1u  [C_0402_Generic]
C95  1u  [C_0402_Generic]
C96  22u  [C_0603_Generic]
C97  10u  [C_0402_Generic]
C98  22u  [C_0603_Generic]
C99  47u  [C_0603_Generic]
C100  0.1u  [C_0402_Generic]
C101  1u  [C_0402_Generic]
R107  10K  [R_0402_Generic]
R108  1K  [R_0402_Generic]
R109  3K57  [R_0402_Generic]
R110  6K2  [R_0402_Generic]
R111  4K7  [R_0402_Generic]
R112  261R  [R_0402_Generic]
R113  10K  [R_0402_Generic]
R114  3K57  [R_0402_Generic]
R115  3K57  [R_0402_Generic]
R116  3K57  [R_0402_Generic]
TITLEBLOCK?#20  Capstone_Title_Block  (value not drawn)  (graphical)
U13  AP7176BFN-7  [DIODES_INC_U-DFN3030-10]
U14  AP7176BFN-7  [DIODES_INC_U-DFN3030-10]
U15  AP7176BFN-7  [DIODES_INC_U-DFN3030-10]

### Nets
1V0_GTX: C88.2 C89.2 R108.2 U13.1(VOUT) U13.2(VOUT) U13.3(VOUT)
1V2_GTX: C98.2 C99.2 R114.2 U15.1(VOUT) U15.2(VOUT) U15.3(VOUT)
1V8: C84.2 C85.2 C96.2 C97.2 U13.7(VIN) U13.8(VIN) U13.9(VIN) U15.7(VIN) U15.8(VIN) U15.9(VIN)
1V8_GTX: C92.2 C93.2 R110.2 U14.1(VOUT) U14.2(VOUT) U14.3(VOUT)
2V5: C86.2 C87.2 U14.7(VIN) U14.8(VIN) U14.9(VIN)
3V3AUX: C90.2 C91.2 C94.2 C95.2 C100.2 C101.2 R107.2 R113.2 U13.10(VCNTL) U14.10(VCNTL) U15.10(VCNTL)
GND: C84.1 C85.1 C86.1 C87.1 C88.1 C89.1 C90.1 C91.1 C92.1 C93.1 C94.1 C95.1 C96.1 C97.1 C98.1 C99.1 C100.1 C101.1 R109.1 R112.1 R116.1 U13.11(GND) U14.11(GND) U15.11(GND)
1V0_GTX_EN: U13.6(EN)
1V0_GTX_PG: R107.1 U13.5(PG)
1V2_GTX_EN: U15.6(EN)
1V2_GTX_PG: R113.1 U15.5(PG)
1V8_GTX_EN: U14.6(EN)
NetR108_1: R108.1 R109.2 U13.4(FB)
NetR110_1: R110.1 R111.2 U14.4(FB)
NetR111_1: R111.1 R112.2
NetR114_1: R114.1 R115.2 U15.4(FB)
NetR115_1: R115.1 R116.2

Not connected (* = marked no-connect by the designer): U14 5(PG)*

### Notes on the sheet
- FPGA GTX 1.0V Supply
- FPGA GTX 1.8V Supply
- FPGA GTX 1.2V Supply
- (in symbol Capstone_Title_Block) Title; Drawn By; Reviewed By; Date; Version; Sheet; of; Size

### Library data of the parts
C84 C86 C96 C98 = GRM188R60J226MEA0D: 22µF 6.3V X5R SMD ceramic capacitor in 0603 size; Manufacturer: Murata Electronics; Manufacturer Part Number: GRM188R60J226MEA0D
C85 C87 C88 C92 C93 C97 = CC0402MRX5R6BB106: as C12 on sheet Management_RP2040; Manufacturer Part Number: CC0402MRX5R6BB106
C89 C99 = GRM188R60J476ME15D: as C113-C118 on sheet FPGA_Power; Manufacturer Part Number: GRM188R60J476ME15D
C90 C94 C100 = GRM155R71C104KA88D: as C1 on sheet Management_RP2040; Manufacturer Part Number: GRM155R71C104KA88D
C91 C95 C101 = GRM155Z71A105KE01D: as C3 on sheet Management_RP2040; Manufacturer Part Number: GRM155Z71A105KE01D
R107 R113 = ERJ-2RKF1002X: as R7-R14 on sheet Management_RP2040; Manufacturer Part Number: ERJ-2RKF1002X
R108 = ERJ-2RKF1001X: as R25-R36 on sheet Power_Input_Indicators; Manufacturer Part Number: ERJ-2RKF1001X
R109 R114-R116 = ERJ-2RKF3571X: 3.57KOhm 1% 1/10W SMD resistor in 0402 size; Manufacturer: Panasonic; Manufacturer Part Number: ERJ-2RKF3571X
R110 = ERJ-2RKF6201X: 6.2KOhm 1% 1/10W SMD resistor in 0402 size; Manufacturer: Panasonic; Manufacturer Part Number: ERJ-2RKF6201X
R111 = ERJ-2RKF4701X: as R1-R3 on sheet Management_RP2040; Manufacturer Part Number: ERJ-2RKF4701X
R112 = ERJ-2RKF2610X: 261Ohm 1% 1/10W SMD resistor in 0402 size; Manufacturer: Panasonic; Manufacturer Part Number: ERJ-2RKF2610X
TITLEBLOCK?#20 = Capstone_Title_Block: as TITLEBLOCK?#12 on sheet Management_RP2040; Manufacturer Part Number: NONE
U13-U15 = AP7176BFN-7: LDO 0.8-3.12V 3A 10-UFDFN Diodes Incorporated; Manufacturer: Diodes Incorporated; Manufacturer Part Number: AP7176BFN-7